# EAGLE design WeBee (EAGLE 7.1.0)

## Sheet 1 of 4
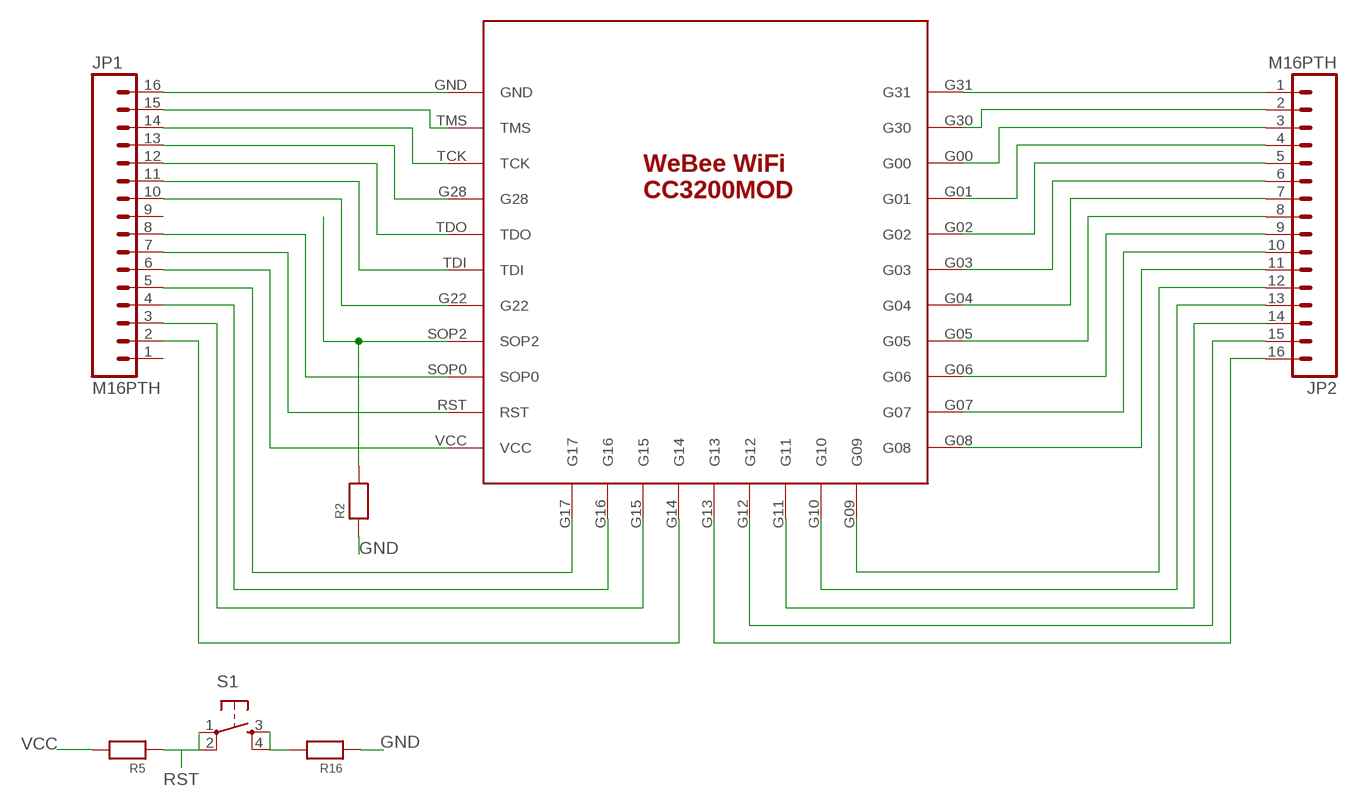
[diagram p0: schematic, sheet 1]

### Parts
JP1  M16PTH  [1X16]
JP2  M16PTH  [1X16]
R2  RESISTOR0402  [0402]
R5  RESISTOR0402  [0402]
R16  RESISTOR0402  [0402]
S1  TAC_SWITCHSMD  [TACTILE_SWITCH_SMD]
U$1  WEBEE_WIFI_CC3200  [CC3200]

### Nets
FTDI_RX: JP2.4 U$1.G01 ; also sheet 4
FTDI_TX: JP2.5 U$1.G02 ; also sheet 4
G00: JP2.3 U$1.G00
GND [vcc]: JP1.16 R2.1 R16.1 U$1.GND ; also sheet 2,3,4
N$1: R16.2 S1.3 S1.4
N$2: JP1.15 U$1.TMS
N$3: JP1.14 U$1.TCK
N$4: JP1.13 U$1.G28
N$5: JP1.12 U$1.TDO
N$6: JP1.11 U$1.TDI
N$7: JP1.10 U$1.G22
N$9: JP1.8 U$1.SOP0
N$12: JP2.1 U$1.G31
N$13: JP2.2 U$1.G30
N$17: JP2.6 U$1.G03
N$18: JP2.7 U$1.G04
N$19: JP2.8 U$1.G05
N$20: JP2.9 U$1.G06
N$21: JP2.10 U$1.G07
N$22: JP2.11 U$1.G08
N$23: JP2.12 U$1.G09
N$24: JP1.5 U$1.G17
N$25: JP2.13 U$1.G10
N$26: JP2.14 U$1.G11
N$27: JP2.15 U$1.G12
N$28: JP2.16 U$1.G13
N$29: JP1.4 U$1.G16
N$30: JP1.3 U$1.G15
N$31: JP1.2 U$1.G14
RST: JP1.7 R5.1 S1.2 U$1.RST ; also sheet 4
SOP2: R2.2 U$1.SOP2 ; also sheet 4
VCC: JP1.6 R5.2 U$1.VCC ; also sheet 3,4
Unconnected: JP1.1 JP1.9 S1.1

## Sheet 2 of 4
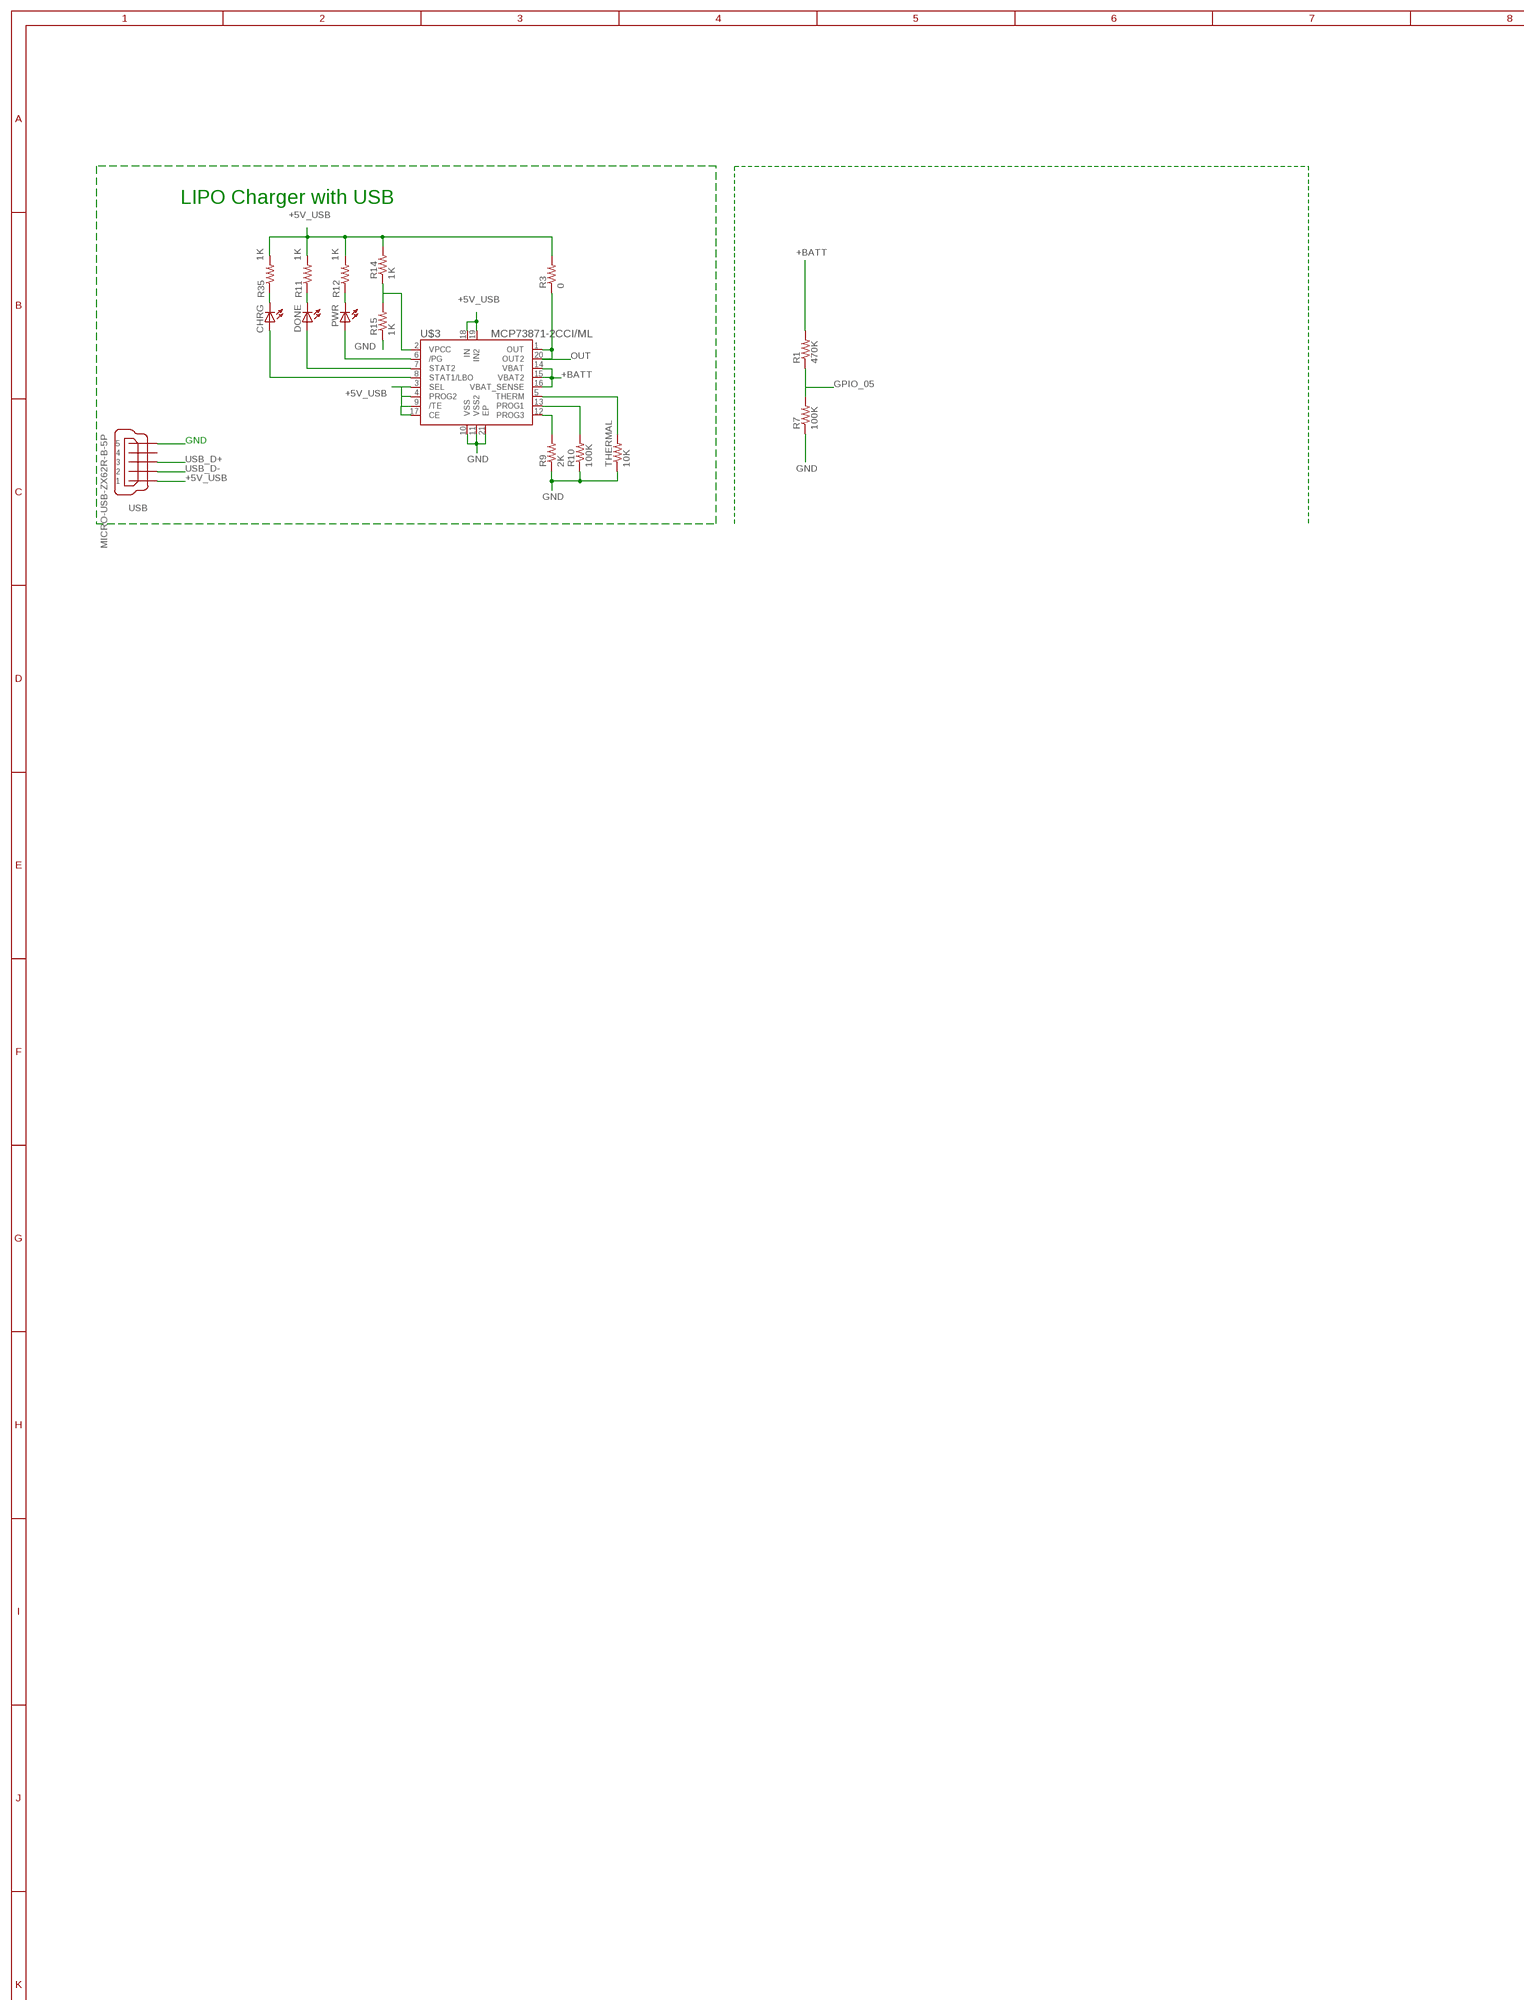
[diagram p1: schematic, sheet 2, part 1 of 3]
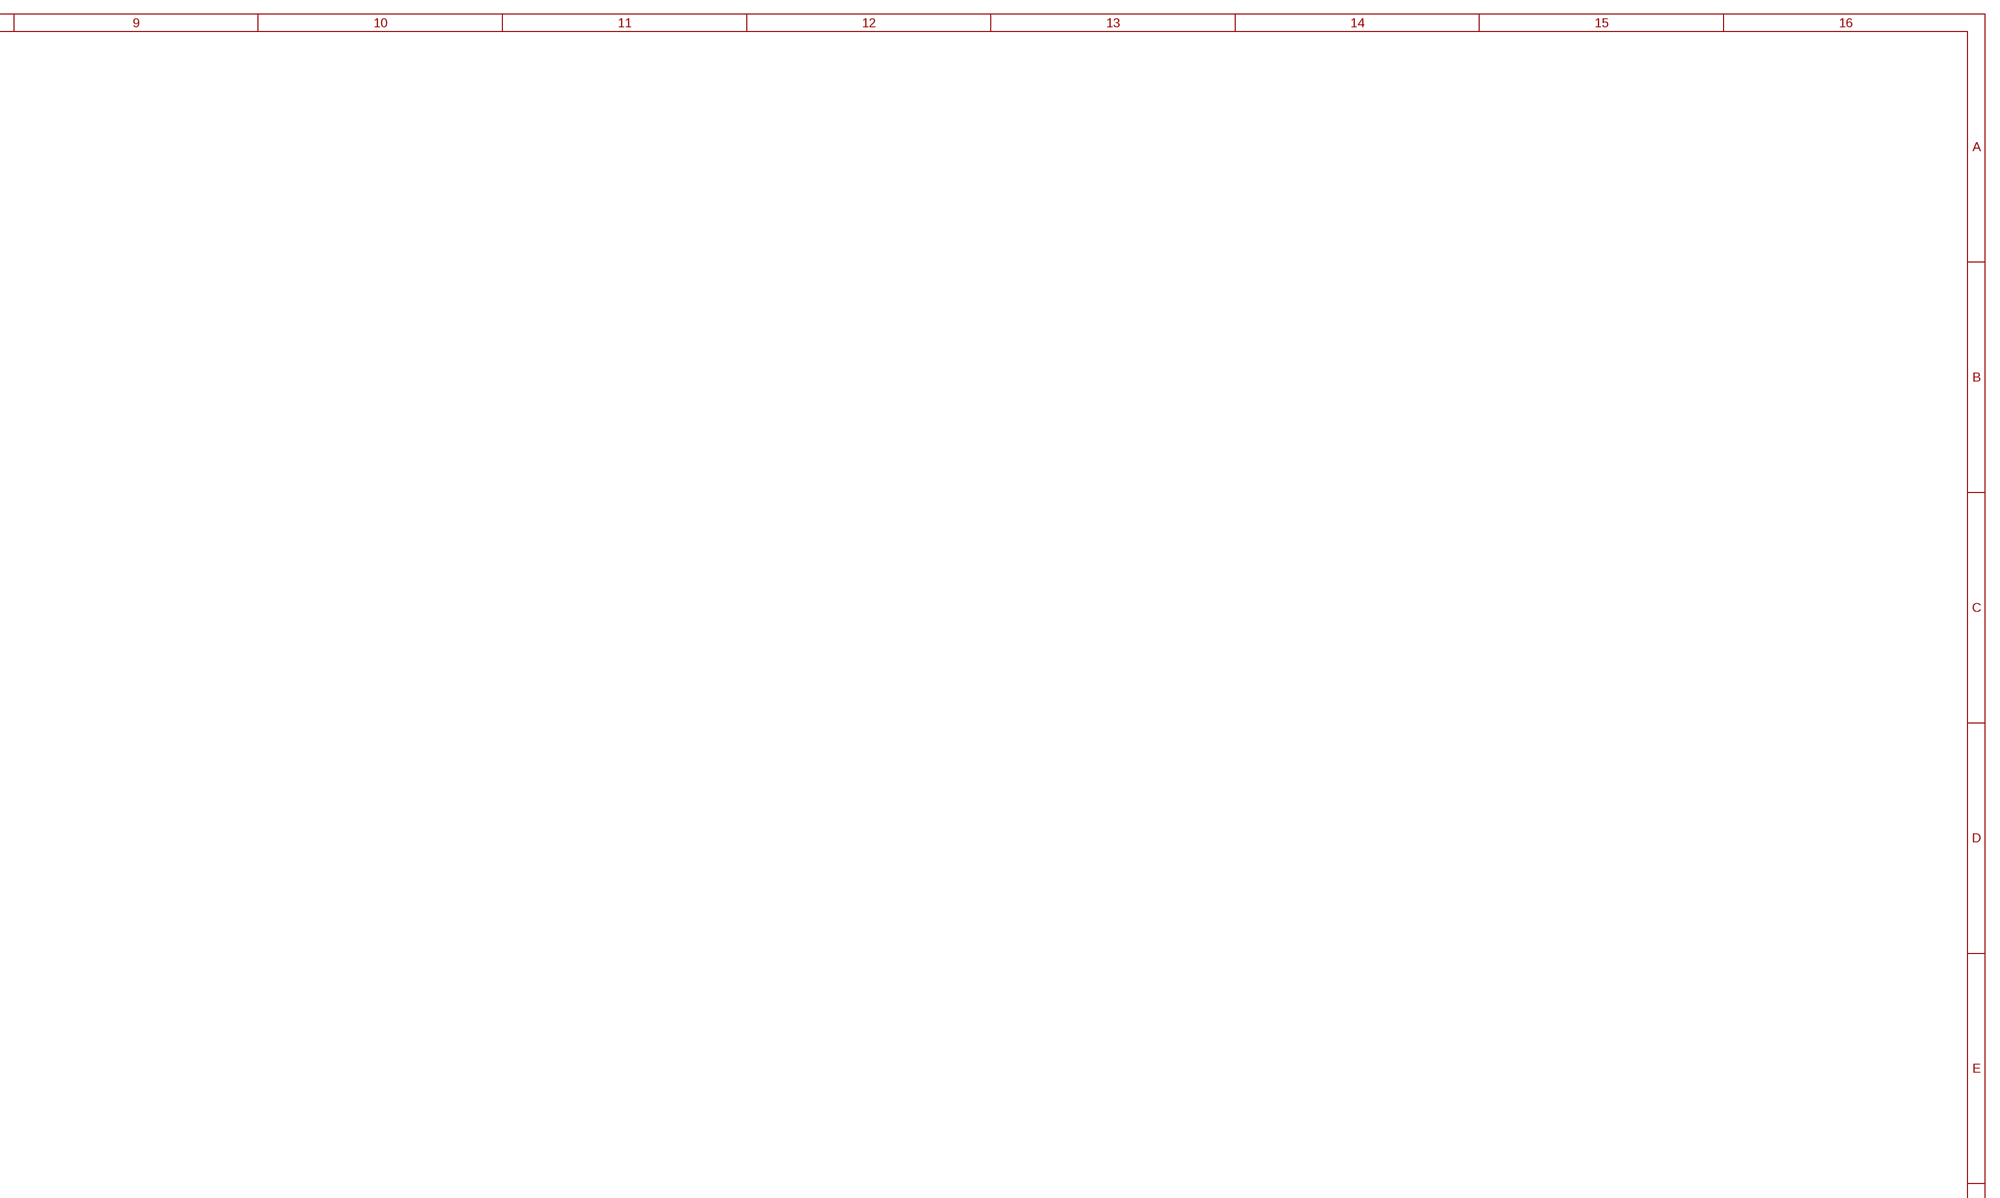
[diagram p2: schematic, sheet 2, part 2 of 3]
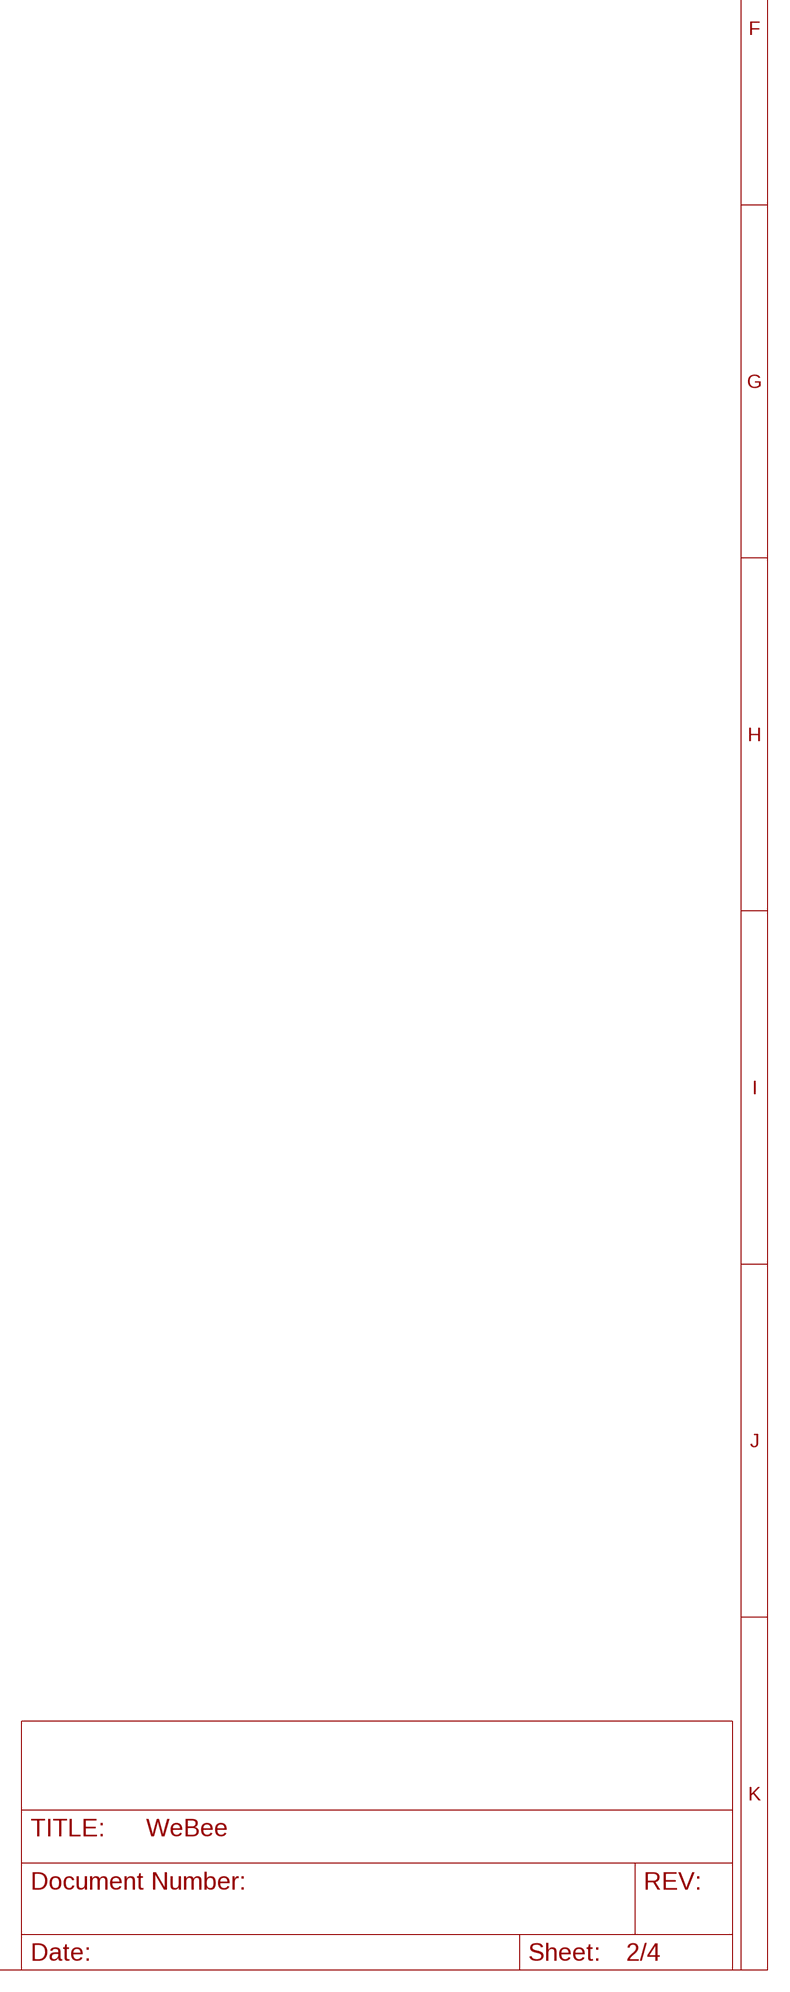
[diagram p3: schematic, sheet 2, part 3 of 3]

### Parts
CHRG  LEDSML0603  [SML0603]
DONE  LEDSML0603  [SML0603]
PWR  LEDSML0603  [SML0603]
R1  470K  RESISTOR0603  [0603-RES]
R3  0  RESISTOR0603-RES  [0603-RES]
R7  100K  RESISTOR0603  [0603-RES]
R9  2K  RESISTOR0603-RES  [0603-RES]
R10  100K  RESISTOR0603-RES  [0603-RES]
R11  1K  RESISTOR0402-RES  [0402-RES]
R12  1K  RESISTOR0402-RES  [0402-RES]
R14  1K  RESISTOR0603-RES  [0603-RES]
R15  1K  RESISTOR0603-RES  [0603-RES]
R35  1K  RESISTOR0402-RES  [0402-RES]
THERMAL  10K  RESISTOR0603-RES  [0603-RES]
U$3  MCP73871-2CCI/ML  [QFN20-4X4]
USB  MICRO-USB-ZX62R-B-5P  [ZX62R-B-5P]

### Nets
+5V_USB: R3.2 R11.2 R12.2 R14.2 R35.2 U$3.3(SEL) U$3.4(PROG2) U$3.9(/TE) U$3.17(CE) U$3.18(IN) U$3.19(IN2) USB.1 ; also sheet 4
+BATT: R1.2 U$3.14(VBAT) U$3.15(VBAT2) U$3.16(VBAT_SENSE) ; also sheet 3
GND [vcc]: R7.1 R9.1 R10.1 R15.1 THERMAL.1 U$3.10(VSS) U$3.11(VSS2) U$3.21(EP) USB.5 ; also sheet 1,3,4
GPIO_05: R1.1 R7.2
N$68: R9.2 U$3.12(PROG3)
N$69: R10.2 U$3.13(PROG1)
N$70: PWR.A U$3.6(/PG)
N$71: DONE.A U$3.7(STAT2)
N$72: CHRG.A U$3.8(STAT1/LBO)
N$73: CHRG.C R35.1
N$74: DONE.C R11.1
N$75: PWR.C R12.1
N$76: R14.1 R15.2 U$3.2(VPCC)
N$77: THERMAL.2 U$3.5(THERM)
OUT: R3.1 U$3.1(OUT) U$3.20(OUT2) ; also sheet 3
USB_D+: USB.3 ; also sheet 4
USB_D-: USB.2 ; also sheet 4
Unconnected: USB.4

### Notes on the sheet
- LIPO Charger with USB
- GND

## Sheet 3 of 4
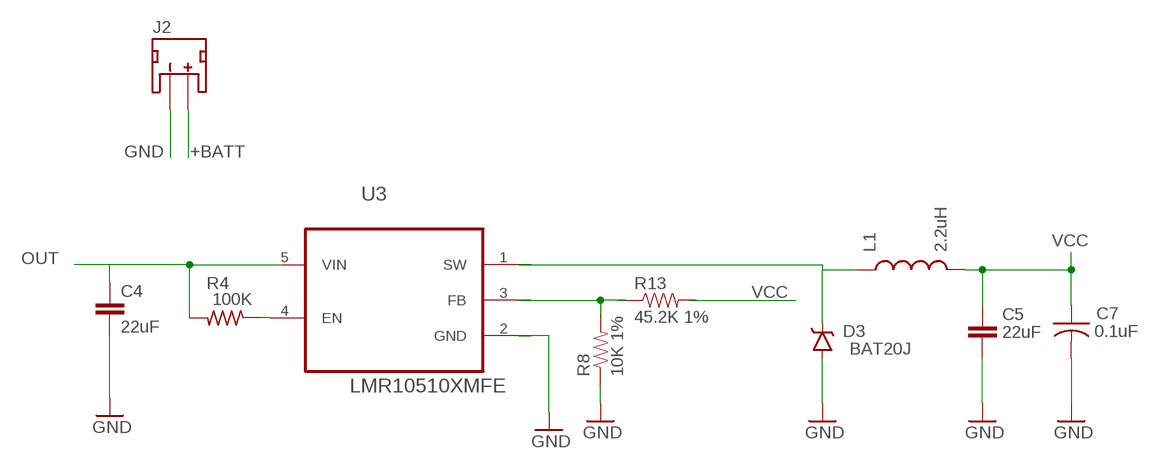
[diagram p4: schematic, sheet 3]

### Parts
C4  22uF  C-EUC0603  [C0603]
C5  22uF  C-EUC0603  [C0603]
C7  0.1uF  C-USC0402  [C0402]
D3  BAT20J  DIODE-SCHOTTKY-BAT20J  [SOD-323]
J2  JST_2MM_MALE  [JST-2-SMD]
L1  2.2uH  INDUCTOR-SPARKFUN0805  [0805]
R4  100K  R-US_R0402  [R0402]
R8  10K 1%  RESISTOR0402-RES  [0402-RES]
R13  45.2K 1%  RESISTOR0402-RES  [0402-RES]
U3  LMR10510XMFE  [SOT95P270X145-5N]

### Nets
+BATT: J2.2(+) ; also sheet 2
FB: R8.2 R13.1 U3.3(FB)
GND [vcc]: C4.2 C5.2 C7.2 D3.A J2.1(-) R8.1 U3.2(GND) ; also sheet 1,2,4
N$11: R4.1 U3.4(EN)
OUT: C4.1 R4.2 U3.5(VIN) ; also sheet 2
SW: D3.C L1.1 U3.1(SW)
VCC: C5.1 C7.1 L1.2 R13.2 ; also sheet 1,4
Unconnected: J2.NC1(PAD1) J2.NC2(PAD2)

## Sheet 4 of 4
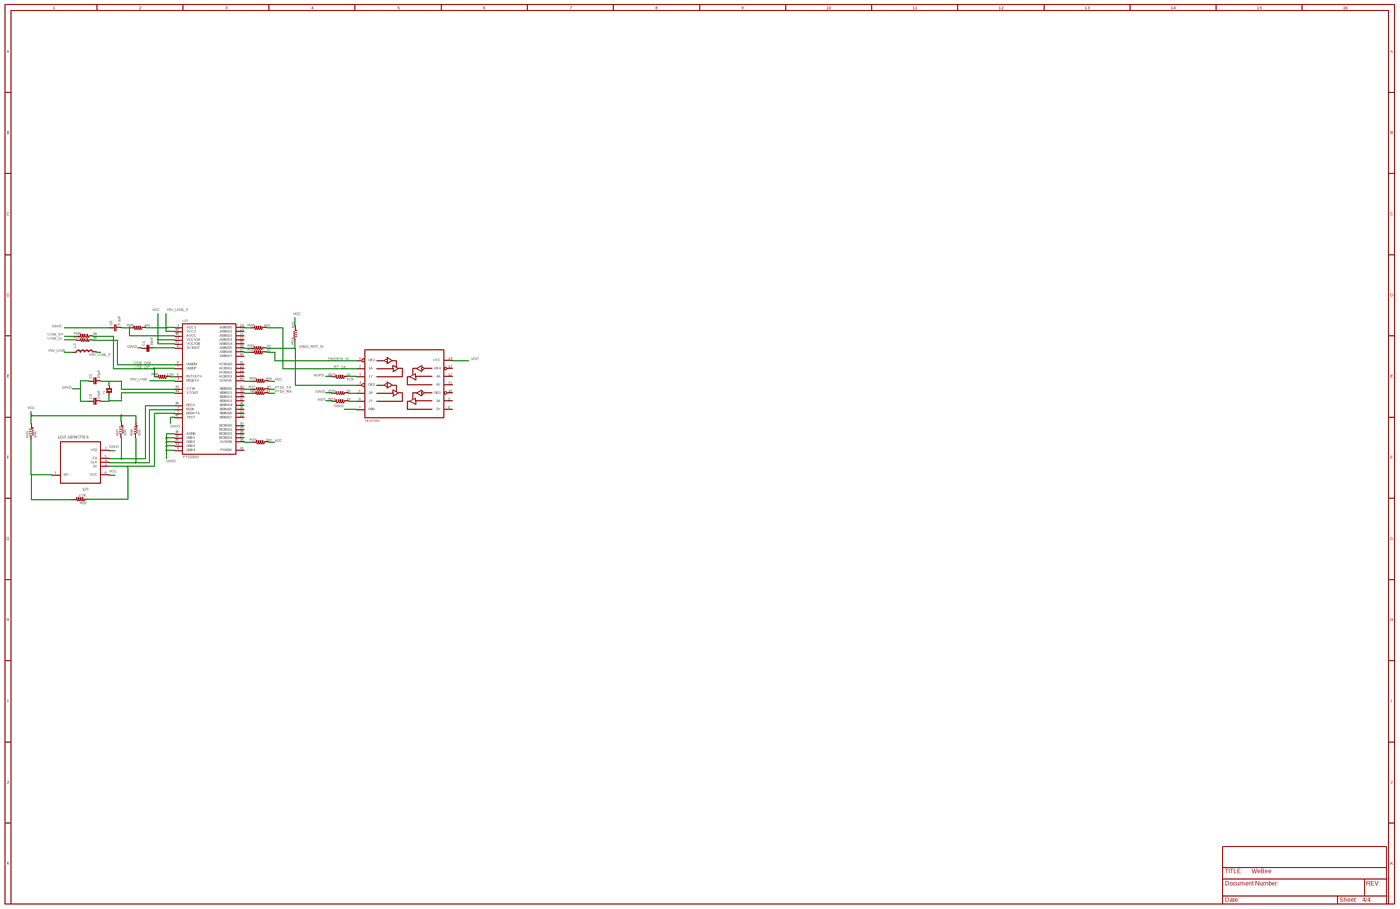
[diagram p5: schematic, sheet 4, overview]
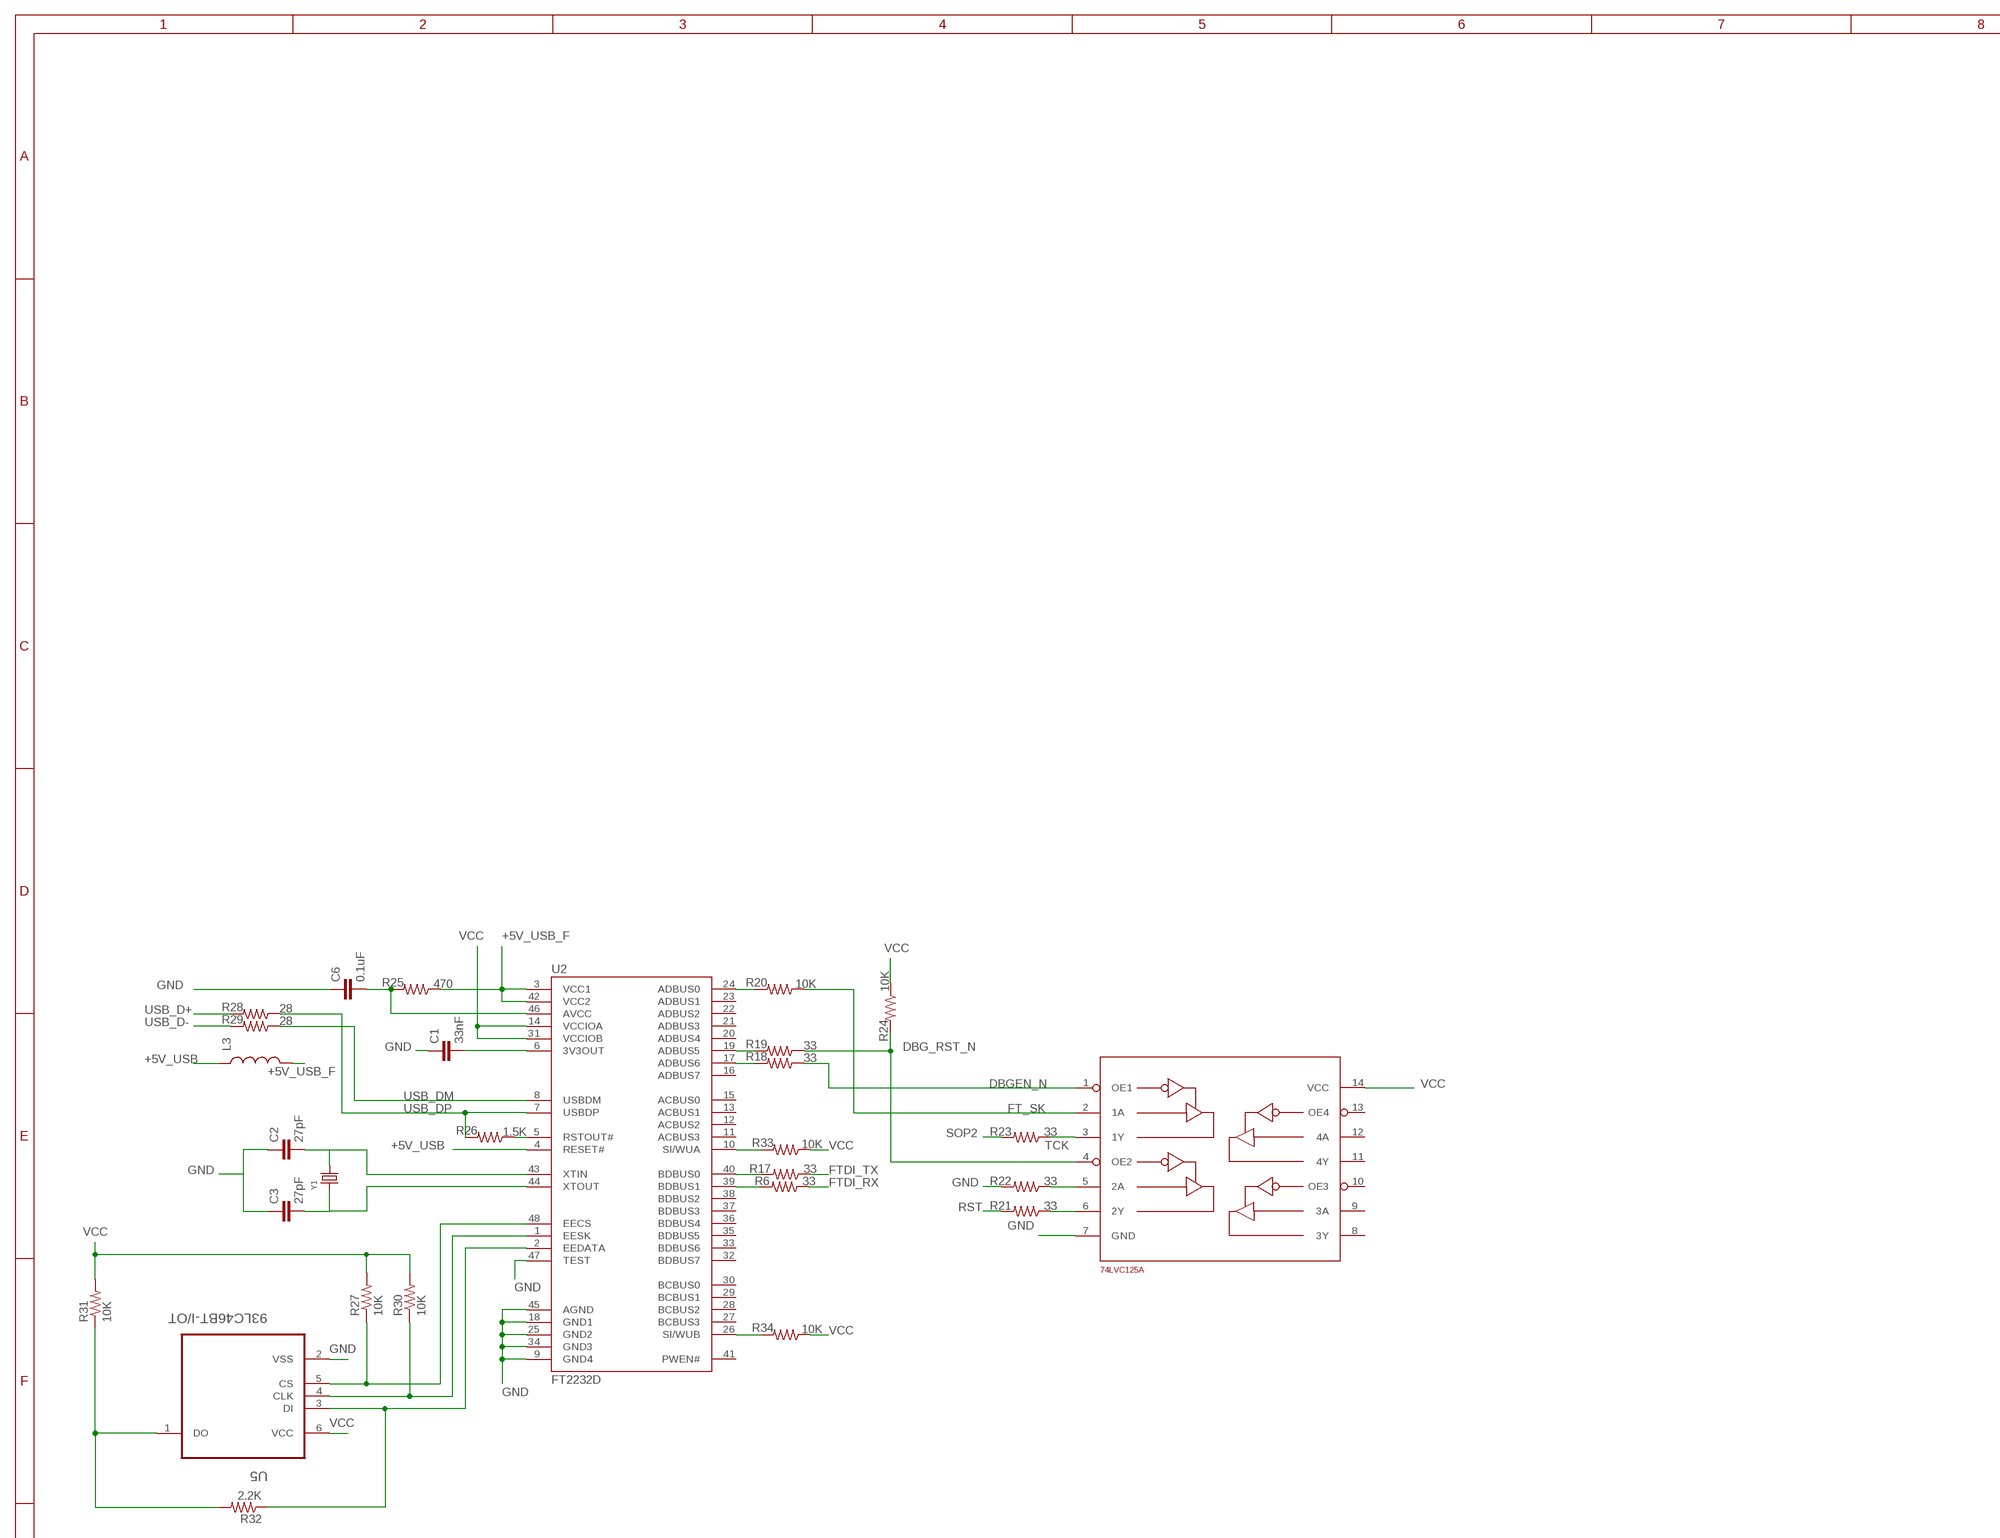
[diagram p6: schematic, sheet 4, part 1 of 4]
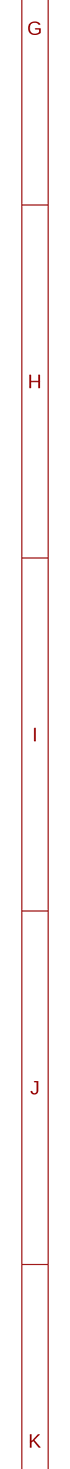
[diagram p7: schematic, sheet 4, part 2 of 4]
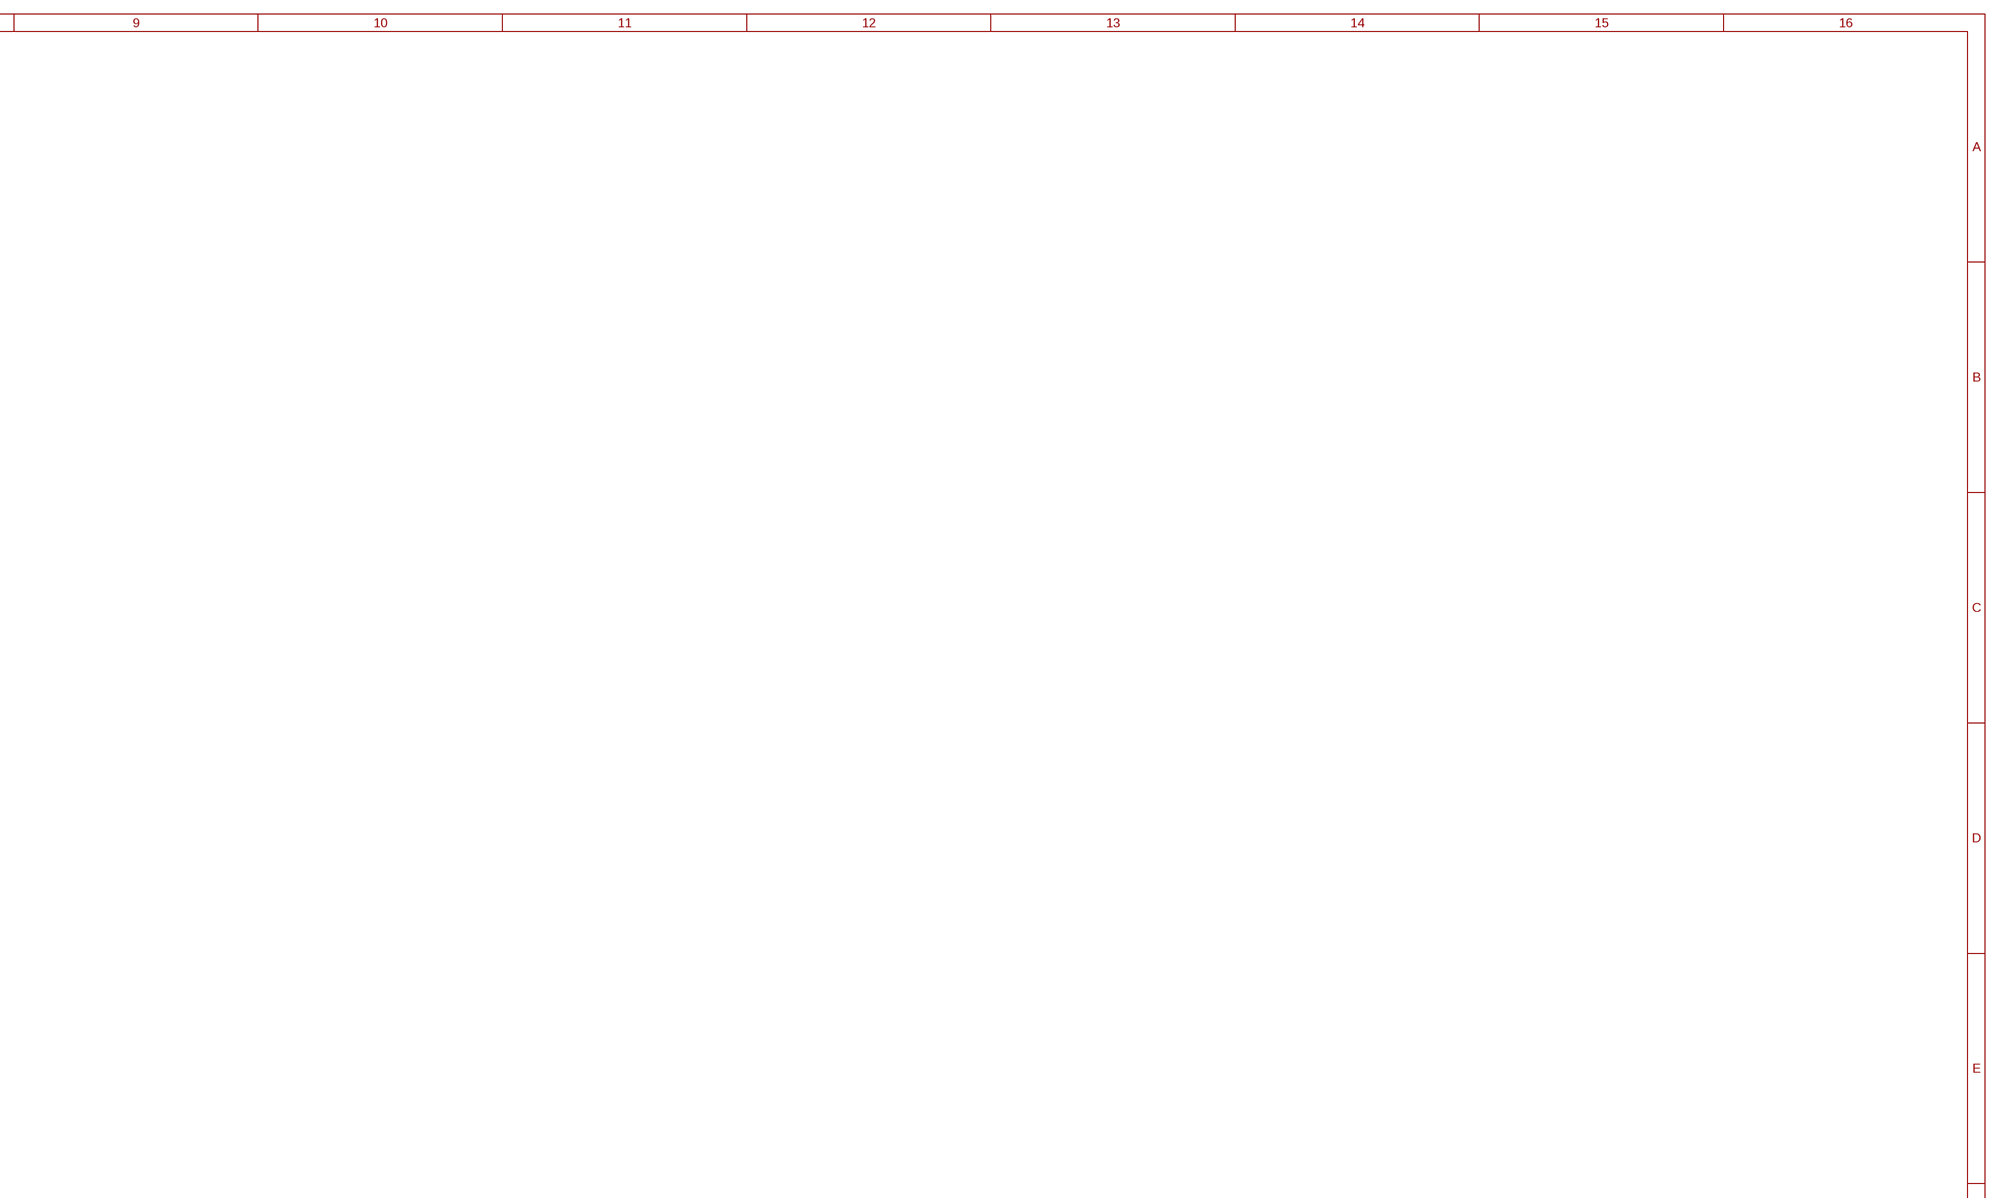
[diagram p8: schematic, sheet 4, part 3 of 4]
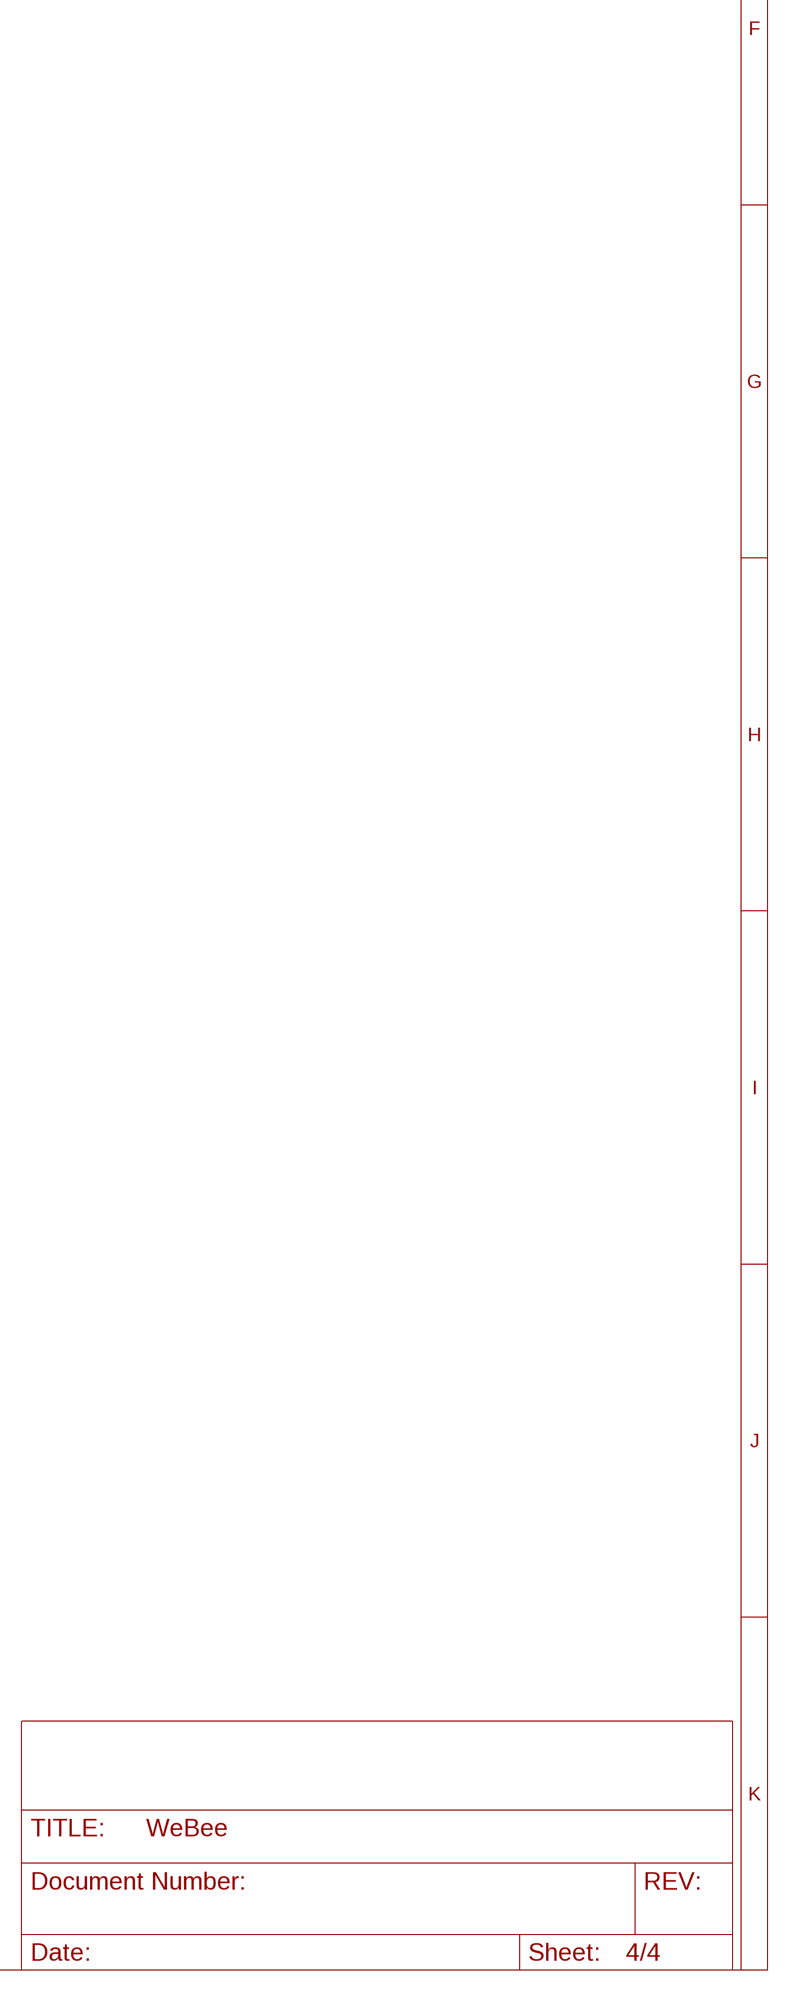
[diagram p9: schematic, sheet 4, part 4 of 4]

### Parts
C1  33nF  CAP0402-CAP  [0402-CAP]
C2  27pF  CAP0402-CAP  [0402-CAP]
C3  27pF  CAP0402-CAP  [0402-CAP]
C6  0.1uF  CAP0402-CAP  [0402-CAP]
L3  INDUCTOR-SPARKFUN0603  [0603]
R6  33  RESISTOR0402-RES  [0402-RES]
R17  33  RESISTOR0402-RES  [0402-RES]
R18  33  RESISTOR0402-RES  [0402-RES]
R19  33  RESISTOR0402-RES  [0402-RES]
R20  10K  RESISTOR0402-RES  [0402-RES]
R21  33  RESISTOR0402-RES  [0402-RES]
R22  33  RESISTOR0402-RES  [0402-RES]
R23  33  RESISTOR0402-RES  [0402-RES]
R24  10K  RESISTOR0402-RES  [0402-RES]
R25  470  RESISTOR0402-RES  [0402-RES]
R26  1.5K  RESISTOR0402-RES  [0402-RES]
R27  10K  RESISTOR0402-RES  [0402-RES]
R28  28  RESISTOR0402-RES  [0402-RES]
R29  28  RESISTOR0402-RES  [0402-RES]
R30  10K  RESISTOR0402-RES  [0402-RES]
R31  10K  RESISTOR0402-RES  [0402-RES]
R32  2.2K  RESISTOR0402-RES  [0402-RES]
R33  10K  RESISTOR0402-RES  [0402-RES]
R34  10K  RESISTOR0402-RES  [0402-RES]
U2  FT2232D  [LQFP-48]
U5  93LC46BT-I/OT  [SOT95P280X145-6N]
U$4  DECADE-74LVC125A  [DECADE-SO-14]
Y1  CRYSTAL2.5X2.0MM  [CRYSTAL_2.5X2]

### Nets
+5V_USB: L3.1 U2.4(RESET#) ; also sheet 2
+5V_USB_F: L3.2 R25.1 U2.3(VCC1) U2.42(VCC2)
DBG_RST_N: R19.1 R24.2 U$4.4(OE2)
DBGEN_N: R18.1 U$4.1(OE1)
FT_SK: R20.1 U$4.2(1A)
FTDI_RX: R6.1 ; also sheet 1
FTDI_TX: R17.1 ; also sheet 1
GND [vcc]: C1.1 C2.1 C3.1 C6.1 R22.2 U2.9(GND4) U2.18(GND1) U2.25(GND2) U2.34(GND3) U2.45(AGND) U2.47(TEST) U5.2(VSS) U$4.7(GND) ; also sheet 1,2,3
N$8: R26.1 U2.5(RSTOUT#)
N$38: C2.2 U2.43(XTIN) Y1.3
N$39: R27.1 U2.48(EECS) U5.5(CS)
N$40: C3.2 U2.44(XTOUT) Y1.1
N$41: R30.1 U2.1(EESK) U5.4(CLK)
N$42: R32.1 U2.2(EEDATA) U5.3(DI)
N$43: C1.2 U2.6(3V3OUT)
N$44: R17.2 U2.40(BDBUS0)
N$45: R6.2 U2.39(BDBUS1)
N$46: R20.2 U2.24(ADBUS0)
N$47: R19.2 U2.19(ADBUS5)
N$48: R18.2 U2.17(ADBUS6)
N$49: R22.1 U$4.5(2A)
N$50: R21.1 U$4.6(2Y)
N$51: C6.2 R25.2 U2.46(AVCC)
N$54: R31.1 R32.2 U5.1(DO)
N$55: R33.2 U2.10(SI/WUA)
N$56: R34.2 U2.26(SI/WUB)
RST: R21.2 ; also sheet 1
SOP2: R23.2 ; also sheet 1
TCK: R23.1 U$4.3(1Y)
USB_D+: R28.2 ; also sheet 2
USB_D-: R29.2 ; also sheet 2
USB_DM: R29.1 U2.8(USBDM)
USB_DP: R26.2 R28.1 U2.7(USBDP)
VCC: R24.1 R27.2 R30.2 R31.2 R33.1 U2.14(VCCIOA) U2.31(VCCIOB) U5.6(VCC) U$4.14(VCC) ; also sheet 1,3
Unconnected: R34.1 U2.11(ACBUS3) U2.12(ACBUS2) U2.13(ACBUS1) U2.15(ACBUS0) U2.16(ADBUS7) U2.20(ADBUS4) U2.21(ADBUS3) U2.22(ADBUS2) U2.23(ADBUS1) U2.27(BCBUS3) U2.28(BCBUS2) U2.29(BCBUS1) U2.30(BCBUS0) U2.32(BDBUS7) U2.33(BDBUS6) U2.35(BDBUS5) U2.36(BDBUS4) U2.37(BDBUS3) U2.38(BDBUS2) U2.41(PWEN#) U$4.8(3Y) U$4.9(3A) U$4.10(OE3) U$4.11(4Y) U$4.12(4A) U$4.13(OE4)

## Library data of the parts
C1-C3 C6 = SparkFun-Passives:CAP: Capacitor Standard 0603 ceramic capacitor, and 0.1" leaded capacitor.
C4 C5 = rcl:C-EU: CAPACITOR, European symbol
C7 = adafruit:C-US: CAPACITOR, American symbol
CHRG DONE PWR = led:LED: LED OSRAM: - CHIPLED LG R971, LG N971, LY N971, LG Q971, LY Q971, LO R971, LY R971 LH N974, LH R974 LS Q976, LO Q976, LY Q976 LO Q996 - Hyper CHIPLED LW Q18S LB Q993, LB Q99A, LB R99A - SideLED LS A670, LO A670, LY A670, LG A670, LP A670 LB A673, LV A673, LT A673, LW A673 LH A674 LY A675 LS A676, LA A676, LO A676, LY A676, LW A676 LS A679, LY A679, LG A679 - Hyper Micro SIDELED® LS Y876, LA Y876, LO Y876, LY Y876 LT Y87S - SmartLED LW L88C, LW L88S LB L89C, LB L89S, LG L890 LS L89K, LO L89K, LY L89K LS L896, LA L896, LO L896, LY L896 - TOPLED LS T670, LO T670, LY T670, LG T670, LP T670 LSG T670, LSP T670, LSY T670, LOP T670, LYG T670 LG T671, LOG T671, LSG T671 LB T673, LV T673, LT T673, LW T673 LH T674 LS T676, LA T676, LO T676, LY T676, LB T676, LH T676, LSB T676, LW T676 LB T67C, LV T67C, LT T67C, LS T67K, LO T67K, LY T67K, LW E67C LS E67B, LA E67B, LO E67B, LY E67B, LB E67C, LV E67C, LT E67C LW T67C LS T679, LY T679, LG T679 LS T770, LO T770, LY T770, LG T770, LP T770 LB T773, LV T773, LT T773, LW T773 LH T774 LS E675, LA E675, LY E675, LS T675 LS T776, LA T776, LO T776, LY T776, LB T776 LHGB T686 LT T68C, LB T68C - Hyper Mini TOPLED® LB M676 - Mini TOPLED Santana® LG M470 LS M47K, LO M47K, LY M47K Source: http://www.osram.convergy.de LUXEON: - LUMILED® LXK2-PW12-R00, LXK2-PW12-S00, LXK2-PW14-U00, LXK2-PW14-V00 LXK2-PM12-R00, LXK2-PM12-S00, LXK2-PM14-U00 LXK2-PE12-Q00, LXK2-PE12-R00, LXK2-PE12-S00, LXK2-PE14-T00, LXK2-PE14-U00 LXK2-PB12-K00, LXK2-PB12-L00, LXK2-PB12-M00, LXK2-PB14-N00, LXK2-PB14-P00, LXK2-PB14-Q00 LXK2-PR12-L00, LXK2-PR12-M00, LXK2-PR14-Q00, LXK2-PR14-R00 LXK2-PD12-Q00, LXK2-PD12-R00, LXK2-PD12-S00 LXK2-PH12-R00, LXK2-PH12-S00 LXK2-PL12-P00, LXK2-PL12-Q00, LXK2-PL12-R00 Source: www.luxeon.com KINGBRIGHT: KA-3528ASYC Source: www.kingbright.com
D3 = SparkFun-DiscreteSemi:DIODE-SCHOTTKY: Schottky diodes in SFE's production catalog BAT20J 1A 23V 0.62Vf RB751 120mA 40V 0.37Vf PMEG4005EJ 0.5A 40V 0.42Vf MBRA140 1A 40V 0.5Vf B340A 3A 40V SMA; PROD_ID: DIO-11623
J2 = SparkFun-Connectors:JST_2MM_MALE: Mates to single-cell LiPo batteries. CONN-08352; PROD_ID: CONN-08352
JP1 JP2 = DECADE-libraries:M16: 1x16 .1" header
L1 L3 = Spark:INDUCTOR-SPARKFUN: Inductors Basic Inductor/Choke - 0603 and 1206. Footprints are not proven and vary greatly between part numbers. SRN6045- 33uH, 20% 1.4A
R1 R7 = SparkFun-Resistors:RESISTOR: Resistor Basic schematic elements and footprints for 0603, 1206, and PTH resistors.
R2 R5 R16 = microbuilder:RESISTOR: Resistors 0402 - 0402 Surface Mount Package 22 Ohm 1% 1/16W [Digikey: 311-22.0LRTR-ND] 33 Ohm 5% 1/16W 1.0K 5% 1/16W 1.5K 5% 1/16W 2.0K 1% 1/16W 10.0K 1% 1/16W [Digikey: 311-10.0KLRTR-ND] 10.0K 5% 1/16W [Digikey: RMCF0402JT10K0TR-ND] 12.1K 1% 1/16W [Digikey: 311-22.0LRTR-ND] 100.0K 5% 1/16W 0603 - 0603 Surface Mount Package 0 Ohm 1/10 Watt 1% Resistor 15 Ohm 1/10 Watt 1% Resistor 33 Ohm 1/10 Watt 1% Resistor 49.9 Ohm 1/10 Watt 1% Resistor 100 Ohm 1/10 Watt 1% Resistor 150 Ohm 1/10 Watt 1% Resistor 240 Ohm 1/10 Watt 1% Resistor 390 Ohm 1/10 Watt 1% Resistor 560 Ohm 1/10 Watt 1% Resistor 680 Ohm 1/10 Watt 1% Resistor 750 Ohm 1/10 Watt 1% Resistor 1.0K Ohm 1/10 Watt 1% Resistor 1.5K Ohm 1/10 Watt 1% Resistor 2.0K Ohm 1/10 Watt 1% Resistor 2.2K Ohm 1/10 Watt 1% Resistor 3.3K Ohm 1/10 Watt 1% Resistor 4.7K Ohm 1/10 Watt 1% Resistor 10.0K Ohm 1/10 Watt 1% Resistor 12.0K Ohm 1/10 Watt 1% Resistor 12.1K Ohm 1/10 Watt 1% Resistor 20.0K Ohm 1/10 Watt 1% Resistor 33.0K Ohm 1/10 Watt 1% Resistor 100.0K Ohm 1/10 Watt 1% Resistor 0805 - 0805 Surface Mount Package 0 Ohm 1/8 Watt 1% Resistor 33 Ohm 1/8 Watt 1% Resistor 100 Ohm 1/8 Watt 1% Resistor 150 Ohm 1/8 Watt 1% Resistor 200 Ohm 1/8 Watt 1% Resistor 240 Ohm 1/8 Watt 1% Resistor 330 Ohm 1/8 Watt 1% Resistor 390 Ohm 1/8 Watt 1% Resistor 470 Ohm 1/8 Watt 1% Resistor 1.0K Ohm 1/8 Watt 1% Resistor 1.5K Ohm 1/8 Watt 1% Resistor 2.0K Ohm 1/8 Watt 1% Resistor 4.7K Ohm 1/8 Watt 1% Resistor 5.1K Ohm 1/8 Watt 1% Resistor 5.6K Ohm 1/8 Watt 1% Resistor 10.0K Ohm 1/8 Watt 1% Resistor 22.0K Ohm 1/8 Watt 1% Resistor 33.0K Ohm 1/8 Watt 1% Resistor 100K Ohm 1/8 Watt 1% Resistor 1206 - 1206 Surface Mount Package 2012 - 2010 Surface Mount Package 0.11 Ohm 1/2 Watt 1% Resistor - Digikey: RHM.11UCT-ND
R3 R6 R8-R15 R17-R35 THERMAL = SparkFun-Passives:RESISTOR: Resistor Basic schematic elements and footprints for 0603, 1206, and PTH resistors.
R4 = adafruit:R-US_: RESISTOR, American symbol
S1 = Spark:TAC_SWITCH: SMD Tactiile Switch
U2 = SparkFun-DigitalIC:FT2232D: USB to USART/FIFO/JTAG/SPI/I2C
U3 = Microchip_By_element14_Batch_1:LMR10510XMFE
U5 = Microchip_By_element14_Batch_1:93LC46BT-I/OT: 1K Microwire Compatible Serial EEPROM; MPN: 93LC46BT-I/OT; OC_FARNELL: 1556164; OC_NEWARK: 75M3689; PACKAGE: SOT-6; SUPPLIER: Microchip
U$1 = WeeBee:WEBEE_WIFI_CC3200
U$3 = microchip-battery:MCP73871: Stand-Alone System Load Sharing and Li-Ion / Li-Polymer Battery Charge Managemen The MCP73871 device is a 1A fully integrated linear solution for system load sharing and Li-Ion / Li-Polymer battery charge management with AC-DC wall adapter and USB port power sources selection. It?s also capable of autonomous power source selection between input or battery. The MCP73871 device employs a constant current/constant voltage (CC/CV) charge algorithm with selectable charge termination point. The constant voltage regulation is fixed with four available options: 4.10V, 4.20V, 4.35V, or 4.40V.; LBO: 3.1 V; SAFETYTIMER: 6 Hours; VREG: 4.20V
U$4 = DECADE-libraries:DECADE-74LVC125A
USB = con-hirose:MICRO-USB-: Hirose Micro USB Connector ZX62R-B-5P: Micro B, reverse (top mount) shell SMT Supplier: DigiKey H11574CT-ND Source: http://www.hirose.co.jp/cataloge_hp/e24200011.pdf
Y1 = microbuilder:CRYSTAL: Crystals HC49UP - Surface Mount Crystal 4.0MHz 18pF +/-30ppm Surface Mount Crystal [Digikey: 535-9857-1-ND] 12.0 MHz Surface Mount Crystal [Digikey: 535-9869-6-ND] 25.0 MHz Surface Mount Crystal [Digikey: 535-9078-1-ND] 2.5 x 2.0mm - MEMs SMT Crystal 16.0 MHz 10pF 20ppm 2.5 x 2.0mm Crystal [Digikey -40-85°C: 535-10923-1-ND] 3.2 x 2.5mm - MEMs SMT Crystal 12.0 MHz 8pF 15ppm 3.2 x 2.5mm Crystal [Digikey: -10-70°C: 644-1047-1-ND -40-125°C: 644-1128-1-ND] 16.0 MHz 8pF 15ppm 3.2 x 2.5mm Crystal [Digikey: -10-70°C: 644-1049-1-ND -40-125°C: 644-1129-2-ND] 16.0 MHz 10pF 10ppm 3.2 x 2.5mm Crystal [Digikey: 644-1100-1-ND] 27.12 MHz 18pF 30ppm 3.2 x 2.5mm Crystal [Digikey: 887-1424-1-ND] 27.12MHz 10pF 10ppm 3.2 x 2.5mm Crystal [Digikey: 887-1329-1-ND] 4.9 x 1.8mm - MEMs SMT Crystal 32.768 KHz 12.5pF 20ppm 4.9 x 1.8mm Crystal [Digikey: SE2415CT-ND] 8.0 x 3.8mm - Surface Mount Crystal 32.768kHz 12.5pF 20ppm -40°C-85°C [Digikey: 535-9166-2-ND] Cylinder 32.768KHz Cylinder Crystal (2x6mm body) [Ex. Digikey: 300-8341-2-ND]

## Board
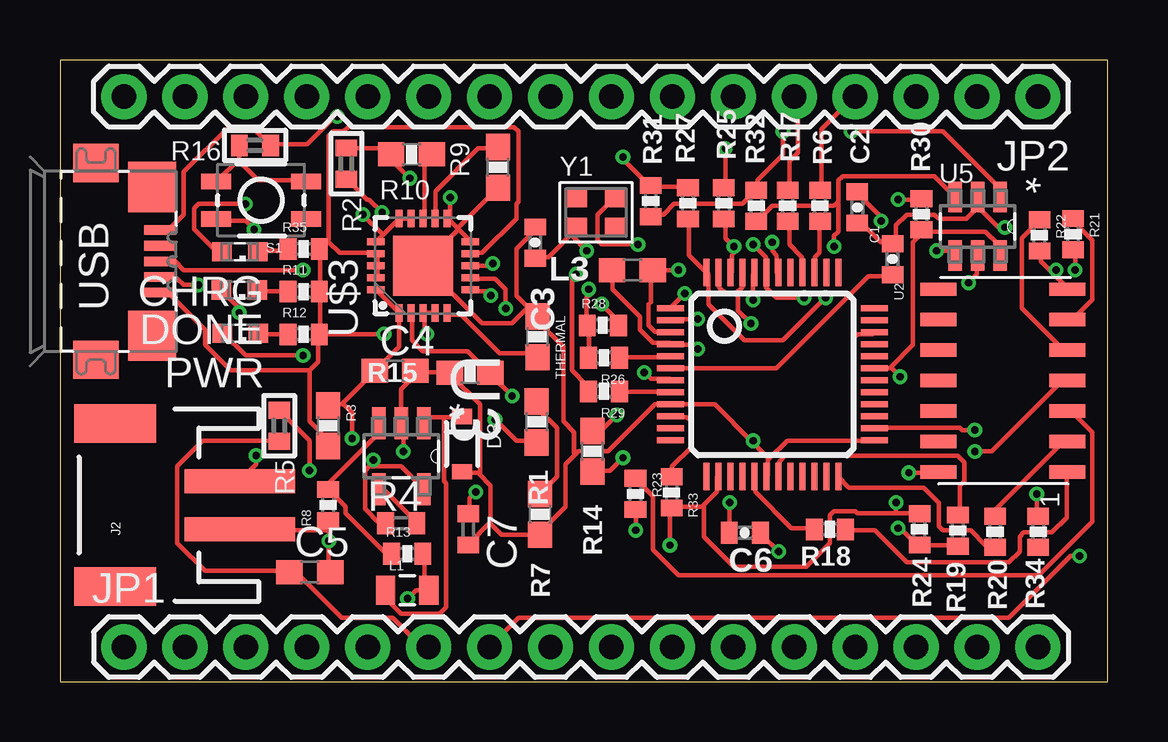
[diagram p10: board, top side]
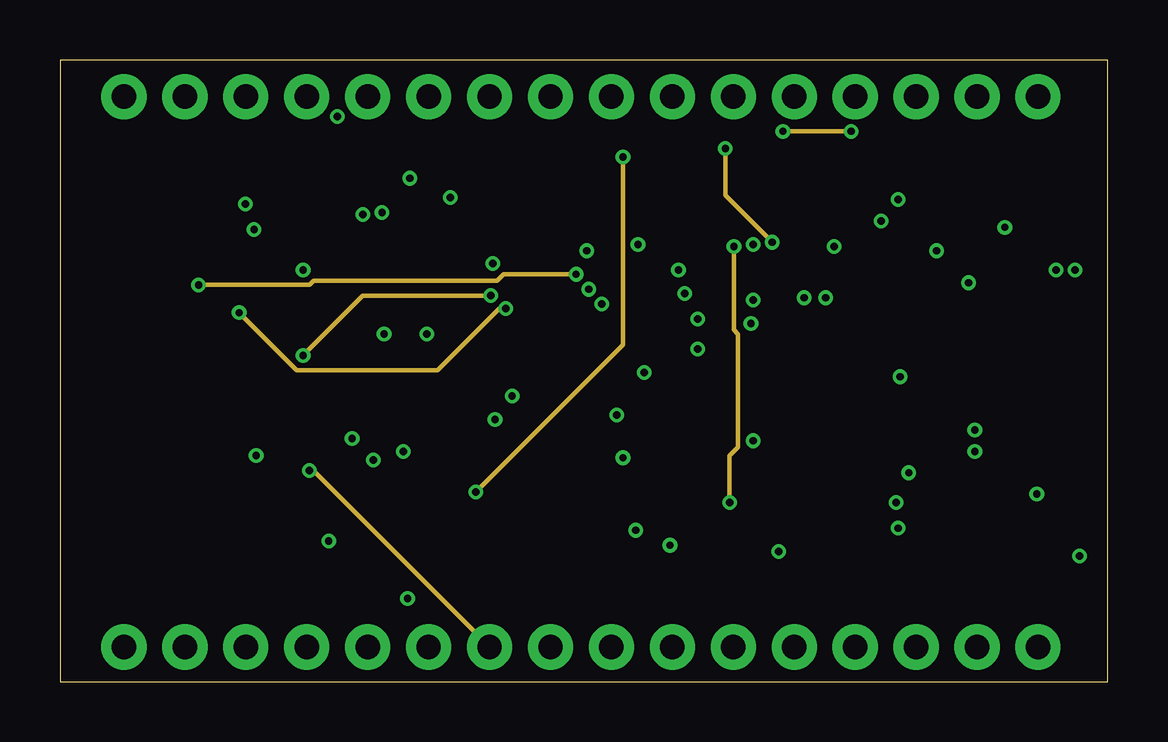
[diagram p11: board, inner layer Route2]
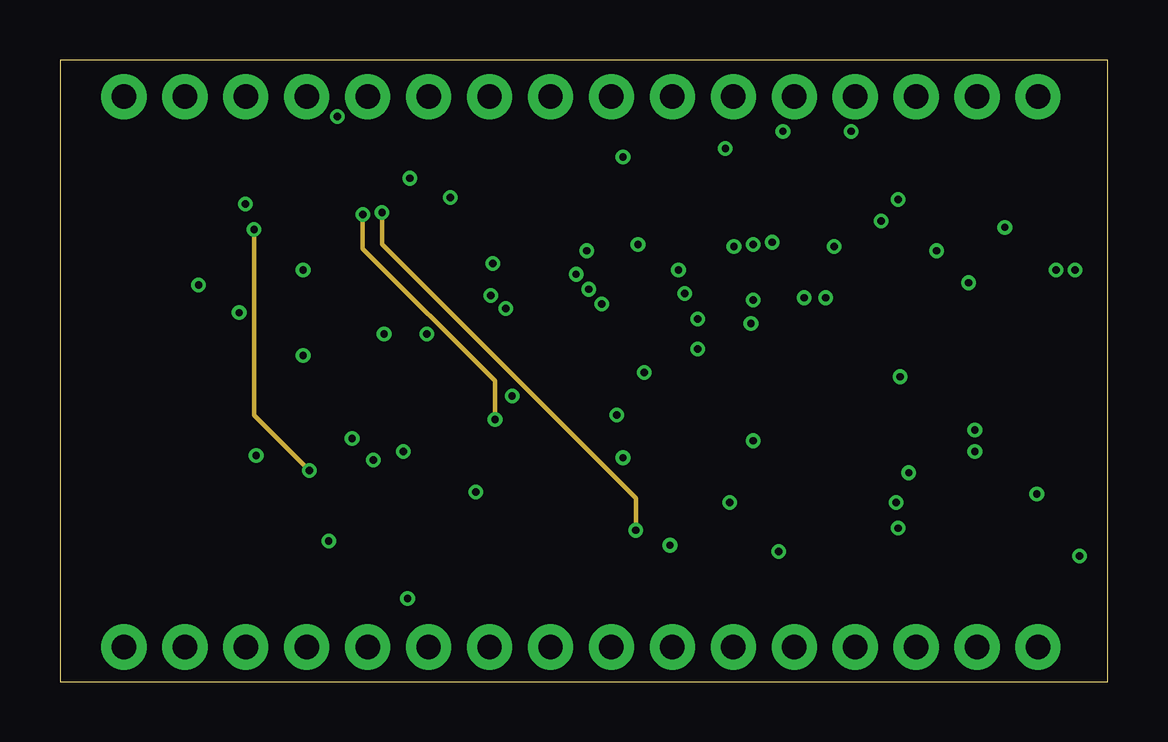
[diagram p12: board, inner layer Route15]
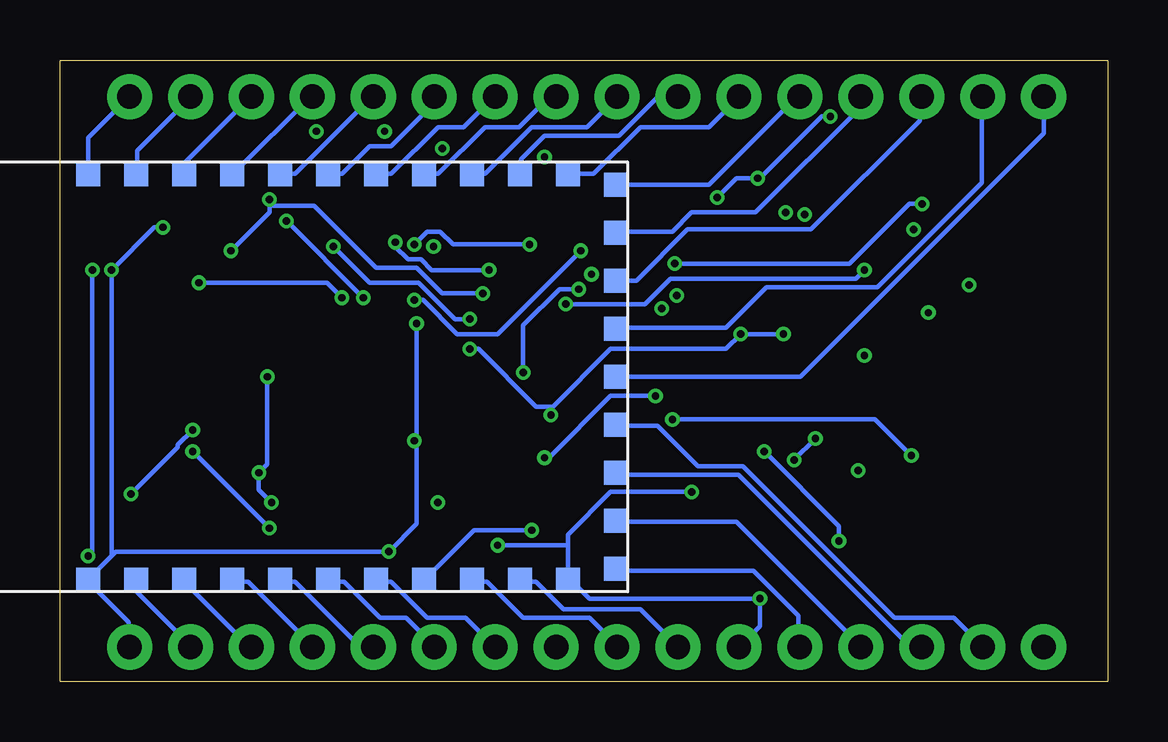
[diagram p13: board, bottom side, seen from below]

Size 43.67 x 25.91 mm. Coordinates in mm from the lower left corner, seen from the top.
Outline: 0,0 43.67,0 43.67,25.91 0,25.91 0,0
Copper layers (1*2*15*16): Top 0.035mm / dielectric 1.5mm / Route2 0.035mm / dielectric 0.15mm / Route15 0.035mm / dielectric 0.2mm / Bottom 0.035mm
Design rules "SmartEagleRules *": minimum track width 7mil, minimum drill 12mil, track to track 7mil, track to pad 7mil, pad to pad 7mil, via to via 7mil, smd to smd 0mil, copper to edge 20mil, drill to drill 10mil, minimum pad ring 10mil, minimum via ring 6mil, stop-mask expansion 2mil, vias tented up to drill 25mil, thermal gap 10mil

### Footprints (pad centres in the part's own frame; a part is rotated, then mirrored left to right if it is on the bottom)
0402-CAP = smd 0.7 x 0.9: 1 -0.65,0; 2 0.65,0
C0603 = smd 1.1 x 1: 1 -0.85,0; 2 0.85,0
C0402 = smd 0.7 x 0.9: 1 -0.65,0; 2 0.65,0
SML0603 = smd 0.8 x 0.8: A 0.75,0; C -0.75,0
SOD-323 = smd 0.63 x 0.83: A 1.15,0; C -1.15,0
JST-2-SMD = smd 1 x 4.6: 1 -1,-3.7; 2 1,-3.7 | smd 1.6 x 3.4: NC1 -3.4,1.5; NC2 3.4,1.5
1X16 = drill 1.016 pad 1.88: 1 0,0; 2 2.54,0; 3 5.08,0; 4 7.62,0; 5 10.16,0; 6 12.7,0; 7 15.24,0; 8 17.78,0; 9 20.32,0; 10 22.86,0; 11 25.4,0; 12 27.94,0; 13 30.48,0; 14 33.02,0; 15 35.56,0; 16 38.1,0
0805 = smd 0.8 x 1.2: 1 -0.9,0; 2 0.9,0
0603 = smd 1.1 x 1: 1 -0.85,0; 2 0.85,0
0603-RES = smd 1.1 x 1: 1 -0.85,0; 2 0.85,0
0402 = smd 0.7 x 0.9: 1 -0.65,0; 2 0.65,0
R0402 = smd 0.7 x 0.9: 1 -0.65,0; 2 0.65,0
0402-RES = smd 0.7 x 0.9: 1 -0.65,0; 2 0.65,0
TACTILE_SWITCH_SMD = smd 1.25 x 0.65: 1 -1.875,0.775; 2 1.875,0.775; 3 -1.875,-0.775; 4 1.875,-0.775
LQFP-48 = smd 0.254 x 1.143: 1 -2.75,-4.25; 2 -2.25,-4.25; 3 -1.75,-4.25; 4 -1.25,-4.25; 5 -0.75,-4.25; 6 -0.25,-4.25; 7 0.25,-4.25; 8 0.75,-4.25; 9 1.25,-4.25; 10 1.75,-4.25; 11 2.25,-4.25; 12 2.75,-4.25; 25 2.75,4.25; 26 2.25,4.25; 27 1.75,4.25; 28 1.25,4.25; 29 0.75,4.25; 30 0.25,4.25; 31 -0.25,4.25; 32 -0.75,4.25; 33 -1.25,4.25; 34 -1.75,4.25; 35 -2.25,4.25; 36 -2.75,4.25 | smd 1.143 x 0.254: 13 4.25,-2.75; 14 4.25,-2.25; 15 4.25,-1.75; 16 4.25,-1.25; 17 4.25,-0.75; 18 4.25,-0.25; 19 4.25,0.25; 20 4.25,0.75; 21 4.25,1.25; 22 4.25,1.75; 23 4.25,2.25; 24 4.25,2.75; 37 -4.25,2.75; 38 -4.25,2.25; 39 -4.25,1.75; 40 -4.25,1.25; 41 -4.25,0.75; 42 -4.25,0.25; 43 -4.25,-0.25; 44 -4.25,-0.75; 45 -4.25,-1.25; 46 -4.25,-1.75; 47 -4.25,-2.25; 48 -4.25,-2.75
SOT95P270X145-5N = smd 1.321 x 0.559: 1 -1.372,0.94; 2 -1.372,0; 3 -1.372,-0.94; 4 1.372,-0.94; 5 1.372,0.94
SOT95P280X145-6N = smd 1.27 x 0.559: 1 -1.219,0.94; 2 -1.219,0; 3 -1.219,-0.94; 4 1.219,-0.94; 5 1.219,0; 6 1.219,0.94
CC3200 = smd 1 x 1: G00 8.455,7; G01 8.455,5; G02 8.455,3; G03 8.455,1; G04 8.455,-1; G05 8.455,-3; G06 8.455,-5; G07 8.455,-7; G08 8.455,-9; G09 8,-11; G10 6,-11; G11 4,-11; G12 2,-11; G13 0,-11; G14 -2,-11; G15 -4,-11; G16 -6,-11; G17 -8,-11; G22 -8.455,-1; G28 -8.455,5; G30 8.455,9; G31 8.455,11; GND -8.455,11; RST -8.455,-7; SOP0 -8.455,-5; SOP2 -8.455,-3; TCK -8.455,7; TDI -8.455,1; TDO -8.455,3; TMS -8.455,9; VCC -8.455,-9
QFN20-4X4 = smd 0.73 x 0.3: 1 -1.965,1; 2 -1.965,0.5; 3 -1.965,0; 4 -1.965,-0.5; 5 -1.965,-1; 11 1.965,-1; 12 1.965,-0.5; 13 1.965,0; 14 1.965,0.5; 15 1.965,1 | smd 0.3 x 0.73: 6 -1,-1.965; 7 -0.5,-1.965; 8 0,-1.965; 9 0.5,-1.965; 10 1,-1.965; 16 1,1.965; 17 0.5,1.965; 18 0,1.965; 19 -0.5,1.965; 20 -1,1.965 | smd 2.5 x 2.5: 21 0,0
DECADE-SO-14 = smd 0.55 x 1.5: 1 -3.6,-2.88; 2 -2.33,-2.88; 3 -1.06,-2.88; 4 0.21,-2.88; 5 1.48,-2.88; 6 2.75,-2.88; 7 4.02,-2.88; 8 4.02,2.5; 9 2.75,2.5; 10 1.48,2.5; 11 0.21,2.5; 12 -1.06,2.5; 13 -2.33,2.5; 14 -3.6,2.5
ZX62R-B-5P = smd 1.35 x 0.4: 1 2.675,-1.3; 2 2.675,-0.65; 3 2.675,0; 4 2.675,0.65; 5 2.675,1.3 | smd 1.9 x 1.6: M1 0,-4.1; M2 0,4.1 | smd 2 x 2.1: M3 2.35,3.1; M4 2.35,-3.1
CRYSTAL_2.5X2 = smd 0.9 x 0.8: 1 -0.825,-0.625; 2 0.825,-0.625; 3 0.825,0.625; 4 -0.825,0.625

### Placement (x,y rotation side)
C1  34.7,17.61 270 top
C2  33.24,19.77 90 top
C3  19.81,18.3 270 top
C4  13.97,12.95 0 top
C5  10.41,4.57 0 top
C6  28.55,6.21 180 top
C7  17.02,6.35 270 top
CHRG  7.5,17.92 180 top
D3  16.76,9.91 270 top
DONE  7.48,16.32 180 top
J2  3.8,7.37 90 top
JP1  2.67,1.45 0 top
JP2  40.77,24.38 180 top
L1  14.48,3.81 0 top
L3  23.86,17.14 0 top
PWR  7.52,14.52 180 top
R1  19.87,10.83 270 top
R2  11.94,21.59 270 top
R3  11.18,10.67 270 top
R4  14.22,6.6 180 top
R5  9.14,10.67 270 top
R6  31.68,19.84 270 top
R7  20.02,6.98 90 top
R8  11.18,7.37 90 top
R9  18.26,21.43 90 top
R10  14.65,21.98 0 top
R11  10.16,16.26 0 top
R12  10.16,14.48 0 top
R13  14.48,5.33 0 top
R14  22.2,9.61 90 top
R15  17.09,12.88 0 top
R16  8.13,22.35 180 top
R17  30.33,19.84 270 top
R18  32.09,6.35 180 top
R19  37.43,6.3 90 top
R20  38.98,6.25 270 top
R21  42.23,18.65 270 top
R22  40.83,18.6 270 top
R23  23.99,7.83 270 top
R24  35.83,6.35 270 top
R25  27.67,19.94 270 top
R26  22.68,13.5 180 top
R27  26.18,19.94 90 top
R28  22.63,14.85 0 top
R29  22.68,12.1 180 top
R30  35.91,19.48 270 top
R31  24.62,20.03 90 top
R32  29.03,19.84 90 top
R33  25.5,7.89 90 top
R34  40.78,6.25 90 top
R35  10.16,18.03 0 top
S1  8.38,20.07 180 top
THERMAL  19.9,14.37 270 top
U2  29.7,12.81 270 top
U3  14.22,9.4 270 top
U5  38.26,18.97 270 top
U$1  31.5,12.7 90 bottom
U$3  15.13,17.34 90 top
U$4  39.12,12.34 90 top
USB  1.5,17.52 0 top
Y1  22.35,19.56 0 top

### Tracks (layer width: path | path; a pad name or v marks a point on that pad's centre or on a via)
+5V_USB  (via drill 0.3)
  Top 0.178: U$3.19 13.25,16.89 13.25,17.34 U$3.18 13.25,17.42 13.25,17.78 U$3.17 13.16,17.87 11.65,17.87 11.16,18.36 | 11.16,18.36 10.85,18.05 R35.2 10.85,17.96 10.85,16.27 R11.2 10.85,16.18 10.85,14.58 R12.2 | 11.16,18.36 11.2,18.4 11.2,22.76 11.38,22.94 11.82,22.94 12,23.11 18.94,23.11 19.11,22.94 19.11,20 19.02,19.91 19.02,19.29 17.6,17.87 17.16,17.87 U$3.9 | L3.1 23.02,17.07 23.02,16.36 24.18,15.2 24.18,14.67 24.71,14.13 25.43,14.13 U2.4 25.51,14.05 26.4,14.05 v26.58,13.87 | U$3.4 15.56,15.38 15.2,15.38 U$3.3 15.2,15.29 15.2,14.58 v15.29,14.49 | v13.51,14.49 10.85,14.49 R12.2 | 10.4,12.98 10.4,10.85 11.11,10.13 11.11,9.87 R3.2 | 10.4,12.98 10.76,13.34 10.76,14.4 R12.2 | v23.2,11.11 22.58,10.49 22.23,10.49 R14.2 | 10.4,12.98 7.11,12.98 6.04,14.05 6.04,14.67 4.53,16.18 4.18,16.18 USB.1
  Bottom 0.178: v13.51,14.49 v15.29,14.49 15.91,13.87 20.71,13.87 23.16,11.42 | v23.2,11.11 23.2,11.38 23.16,11.42 | v26.58,13.87 26.23,13.87 23.82,11.47 23.2,11.47 23.16,11.42
+5V_USB_F  (via drill 0.3)
  Top 0.178: U2.3 25.43,14.58 24.8,14.58 24.54,14.85 24.54,15.73 24.62,15.82 24.62,17.07 L3.2 24.71,17.16 v25.78,17.16 | v27.74,22.23 27.74,20.62 R25.1 | v29.69,18.31 29.69,17.96 29.87,17.78 29.87,17.07 U2.42
  Route2 0.178: v27.74,22.23 27.74,20.27 v29.69,18.31
  Bottom 0.178: v25.78,17.16 28.18,17.16 28.63,17.6 29.16,17.6 29.69,18.14 v29.69,18.31
+BATT  (via drill 0.3)
  Top 0.178: 13.47,18.62 U$3.15 14.22,19.29 14.58,19.29 U$3.14 | 13.47,18.62 13.25,18.4 U$3.16 | v18.14,10.94 19.02,10.05 19.82,10.05 R1.2 | v8.18,9.42 8.18,9.07 7.56,8.45 J2.2 | v12.62,19.47 13.47,18.62
  Route15 0.178: v12.62,19.47 12.62,18.05 18.14,12.54 v18.14,10.94
  Bottom 0.178: v18.14,10.94 9.69,10.94 v8.18,9.42
DBG_RST_N  (via drill 0.3)
  Top 0.178: R19.1 37.43,5.69 35.92,5.69 R24.2 35.74,5.69 35.03,6.4 v34.94,6.4 | v38.14,9.6 38.85,9.6 41.78,12.54 41.96,12.54 U$4.4
  Bottom 0.178: v38.14,9.6 v34.94,6.4
DBGEN_N
  Top 0.178: R18.1 32.8,6.31 33.96,6.31 35.29,4.98 39.56,4.98 40.01,5.42 40.01,6.04 40.18,6.22 41.34,6.22 41.96,6.84 41.96,8.71 U$4.1
FB
  Top 0.178: R13.1 13.6,5.33 11.91,7.02 11.91,7.29 11.2,8 R8.2 11.2,8.09 11.2,8.27 13.25,10.31 13.25,10.76 U3.3
FT_SK
  Top 0.178: R20.1 39.03,6.93 39.03,7.2 41.78,9.96 41.96,9.96 U$4.2
FTDI_RX
  Top 0.178: R6.1 31.74,20.54 31.74,23.02 33.07,24.36 JP2.4
  Bottom 0.178: U$1.G01 36.45,21.16 33.16,24.45 JP2.4
FTDI_TX
  Top 0.178: R17.1 30.4,20.54 30.4,21.69 30.76,22.05 30.76,24.27 30.67,24.36 JP2.5
  Bottom 0.178: U$1.G02 33.87,21.16 30.67,24.36 JP2.5
G00
  Bottom 0.178: U$1.G00 38.49,21.6 35.74,24.36 JP2.3
GND  (via drill 0.3)
  Top 0.178: C2.1 33.43,19.11 34.23,18.31 34.67,18.31 C1.1 34.67,18.4 34.85,18.58 34.85,19.02 35.29,19.47 36.45,19.47 36.63,19.29 37.78,19.29 38.23,19.74 38.23,20.18 U5.2 38.23,19.65 38.41,19.65 39.12,18.94 v39.38,18.94 | 41.38,17.02 41.96,16.45 U$4.7 | 41.38,17.02 40.89,17.51 40.89,17.87 R22.2 | 28.23,16.22 28.45,16.45 U2.45 | 28.23,16.22 28.18,16.18 27.74,16.18 27.47,16.45 27.47,16.98 U2.47 | v29.96,5.42 29.25,6.13 C6.1 | v28.8,14.94 28.27,15.47 28.27,16.18 28.23,16.22 | v41.52,17.16 41.38,17.02 | C3.1 19.74,18.94 19.74,18.76 19.02,18.05 19.02,16.09 19.82,15.29 THERMAL.1 | THERMAL.1 19.47,15.56 18.85,14.94 17.6,14.94 15.2,17.34 U$3.21 15.2,17.42 16.62,18.85 | USB.5 4.18,18.85 4.53,18.85 5.16,19.47 5.16,21.25 7.02,23.11 8,23.11 8.71,22.4 R16.1 8.8,22.4 10.31,22.4 11.47,23.56 v11.56,23.56 | R2.1 12,22.23 13.6,22.23 13.78,22.05 R10.1 13.87,21.96 13.87,21.69 v14.58,20.98 | 16.62,18.85 17.07,18.4 U$3.10 | 16.62,18.85 16.58,18.89 | 16.58,18.89 16.18,19.29 U$3.11 16.27,19.29 v16.27,20.18 | 16.58,18.89 18.22,20.54 R9.1 | 29.56,9.29 30.32,10.05 33.07,10.05 | 29.56,9.29 29.52,9.25 29.52,8.62 U2.18 | 33.07,10.05 33.87,10.05 U2.25 | 29.56,9.29 28.85,10 | 28.85,10 27.29,11.56 25.51,11.56 U2.9 25.43,11.56 24.8,11.56 22.85,9.6 21.6,9.6 21.47,9.47 | 33.07,10.05 33.07,14.31 33.25,14.49 33.87,14.49 U2.34 | 11.2,6.31 v11.2,5.87 11.2,4.62 C5.2 | 11.2,6.31 11.2,6.67 R8.1 | 11.2,6.31 7.56,6.31 J2.1 | 17.47,8.67 17.96,8.18 17.96,6.67 17.91,6.62 | 17.47,8.67 17.42,8.71 16.8,8.71 D3.A | 17.91,6.62 17.07,5.78 C7.2 | 17.91,6.62 18.4,6.13 20,6.13 R7.1 20,6.22 21.07,7.29 21.07,9.07 21.47,9.47 | 17.47,8.67 17.51,8.71 17.51,11.56 16.27,12.8 R15.1 16.18,12.89 14.85,12.89 C4.2 14.85,12.8 14.22,12.18 U3.2 14.22,10.76 14.31,10.67 v14.31,9.6
  Top 0.178: THERMAL.1 19.91,15.2 19.91,15.02 20.98,13.96 20.98,10.85 21.43,10.4 21.43,9.51 21.47,9.47 | v28.89,10.05 28.85,10
  Bottom 0.178: 41.47,5.29 42.49,4.27 U$1.GND 42.49,4.18 40.8,2.49 40.8,1.51 JP1.16 | 41.47,5.29 41.34,5.42 v29.96,5.42 28.8,6.58 28.8,10.05 | 28.8,10.05 v28.8,14.94 | 41.47,5.29 41.52,5.33 v41.52,17.16 39.74,18.94 v39.38,18.94 | v16.27,20.18 15.47,20.98 v14.58,20.98 14.49,20.98 11.91,23.56 v11.56,23.56 | v11.2,5.87 11.2,6.49 v14.31,9.6 | v28.89,10.05 28.8,10.05
GPIO_05
  Top 0.178: R1.1 19.91,11.65 19.91,11.38 20.71,10.58 20.71,8.53 20.09,7.91 R7.2
N$1
  Top 0.178: 7.42,21.74 6.58,20.89 S1.4 | 7.42,21.74 7.47,21.78 7.47,22.31 R16.2 | 7.42,21.74 8.27,20.89 10.22,20.89 S1.3
N$2
  Bottom 0.178: U$1.TMS 40.45,4.18 40.45,3.73 38.23,1.51 JP1.15
N$3
  Bottom 0.178: U$1.TCK 38.49,4.18 35.74,1.42 JP1.14
N$4
  Bottom 0.178: U$1.G28 36.45,4.18 35.83,4.18 33.16,1.51 JP1.13
N$5
  Bottom 0.178: U$1.TDO 34.49,4.18 33.87,4.18 31.2,1.51 30.67,1.51 JP1.12
N$6
  Bottom 0.178: U$1.TDI 32.45,4.18 31.83,4.18 30.32,2.67 29.25,2.67 28.09,1.51 JP1.11
N$7
  Bottom 0.178: U$1.G22 30.49,4.18 29.87,4.18 28.36,2.67 26.76,2.67 25.6,1.51 JP1.10
N$8
  Top 0.178: R26.1 23.38,13.51 25.43,13.51 U2.5
N$9
  Bottom 0.178: U$1.SOP0 26.49,4.18 25.87,4.18 24.36,2.67 21.6,2.67 20.45,1.51 JP1.8
N$11
  Top 0.178: R4.1 14.85,6.67 13.51,8 13.34,8 U3.4
N$12
  Bottom 0.178: U$1.G31 42.49,22.67 40.8,24.36 JP2.1
N$13
  Bottom 0.178: U$1.G30 40.45,21.16 40.45,22.14 38.23,24.36 JP2.2
N$17
  Bottom 0.178: U$1.G03 32.45,21.16 31.91,21.16 30.76,22.31 29.87,22.31 28.09,24.09 28.09,24.36 JP2.6
N$18
  Bottom 0.178: U$1.G04 29.87,21.16 27.91,23.11 26.85,23.11 25.6,24.36 JP2.7
N$19
  Bottom 0.178: U$1.G05 28.45,21.16 27.91,21.16 25.96,23.11 24.54,23.11 23.29,24.36 23.02,24.36 JP2.8
N$20
  Bottom 0.178: U$1.G06 25.96,21.16 24,23.11 21.69,23.11 20.45,24.36 JP2.9
N$21
  Bottom 0.178: U$1.G07 24.45,21.16 24.45,21.78 23.47,22.76 20.36,22.76 18.76,24.36 17.96,24.36 JP2.10
N$22
  Bottom 0.178: U$1.G08 21.43,21.16 19.47,23.11 16.62,23.11 15.38,24.36 JP2.11
N$23
  Bottom 0.178: U$1.G09 20.45,20.71 16.62,20.71 12.89,24.45 JP2.12
N$24
  Bottom 0.178: U$1.G17 20.45,4.62 14.76,4.62 12.89,2.76 12.89,1.51 JP1.5
N$25
  Bottom 0.178: U$1.G10 20.45,18.76 18.14,18.76 17.34,19.56 14.67,19.56 10.31,23.91 10.31,24.36 JP2.13
N$26
  Bottom 0.178: U$1.G11 20.45,16.71 19.65,16.71 17.51,18.85 12.36,18.85 7.82,23.38 7.82,24.36 JP2.14
N$27
  Bottom 0.178: U$1.G12 20.45,14.76 15.91,14.76 14.22,16.45 9.6,16.45 5.25,20.8 5.25,24.36 JP2.15
N$28
  Bottom 0.178: JP2.16 2.67,22.85 12.8,12.71 20.45,12.71 U$1.G13
N$29
  Bottom 0.178: U$1.G16 20.45,6.67 15.47,6.67 10.31,1.51 JP1.4
N$30
  Bottom 0.178: U$1.G15 20.45,8.62 15.38,8.62 8.27,1.51 7.82,1.51 JP1.3
N$31
  Bottom 0.178: U$1.G14 20.45,10.67 18.76,10.67 17.07,8.98 15.2,8.98 8.89,2.67 6.4,2.67 5.25,1.51 JP1.2
N$38  (via drill 0.3)
  Top 0.178: v24.09,18.22 22.58,18.22 22.4,18.4 22.4,19.47 23.11,20.18 Y1.3 | v28.89,18.22 29.43,17.69 29.43,17.07 U2.43 29.43,16.98 29.43,16.45 29.87,16 v31.03,16 | v34.23,19.2 34.23,19.38 33.25,20.36 C2.2
  Bottom 0.178: v24.09,18.22 27.29,18.22 27.83,18.76 28.36,18.76 v28.89,18.22 | v31.03,16 v34.23,19.2
N$39  (via drill 0.3)
  Top 0.178: R27.1 26.23,19.2 26.23,17.78 26.94,17.07 U2.48 27.03,16.98 27.03,15.73 28.54,14.22 30.14,14.22 v31.91,16 | v37.87,16.62 38.23,16.98 38.23,17.69 U5.5
  Bottom 0.178: v37.87,16.62 32.54,16.62 v31.91,16
N$40  (via drill 0.3)
  Top 0.178: C3.2 19.82,17.69 20.36,17.69 21.51,18.85 Y1.1 21.34,18.58 v21.96,17.96 | v28.89,15.91 28.89,16.98 U2.44
  Bottom 0.178: v28.89,15.91 28.54,15.91 27.11,14.49 25.43,14.49 v21.96,17.96
N$41  (via drill 0.3)
  Top 0.178: v34.94,20.09 35.83,20.09 R30.1 | v36.54,17.96 37.07,17.96 37.25,17.78 U5.4 | v26.05,16.18 25.51,15.65 U2.1
  Bottom 0.178: 34.94,19.82 34.94,19.56 v36.54,17.96 | v26.05,16.18 27.74,16.18 28.8,17.25 30.49,17.25 33.07,19.82 34.94,19.82 | 34.94,19.82 v34.94,20.09
N$42  (via drill 0.3)
  Top 0.178: 32.4,19.96 32.45,20 32.45,20.89 32.63,21.07 36.45,21.07 37.25,20.27 U5.3 | 32.4,19.96 32.27,19.82 29.69,19.82 29.07,19.2 R32.1 | v26.58,15.11 25.51,15.11 U2.2 | v32.27,18.14 32.27,18.58 32.45,18.76 32.45,19.91 32.4,19.96
  Bottom 0.178: v26.58,15.11 27.2,15.11 28.71,16.62 30.76,16.62 v32.27,18.14
N$43
  Top 0.178: C1.2 34.67,16.89 33.69,16.89 29.87,13.07 25.51,13.07 U2.6
N$44
  Top 0.178: R17.2 30.4,19.11 30.4,18.22 30.94,17.69 30.94,17.07 U2.40
N$45
  Top 0.178: R6.2 31.65,19.11 31.65,17.87 31.47,17.69 31.47,17.07 U2.39
N$46
  Top 0.178: R20.2 38.94,5.69 38.58,5.69 37.96,6.31 36.8,6.31 36.63,6.49 36.63,7.47 36.01,8.09 32.89,8.09 32.45,8.53 U2.24
N$47
  Top 0.178: R19.2 37.52,7.02 37.52,8.18 37.69,8.36 37.69,9.16 37.43,9.42 30.23,9.42 29.96,9.16 29.96,8.62 U2.19
N$48
  Top 0.178: R18.2 31.38,6.4 30.49,6.4 28.98,7.91 28.98,8.53 U2.17
N$49
  Top 0.178: R22.1 40.8,19.2 40.09,18.49 40.09,15.56 41.78,13.87 41.96,13.87 U$4.5
N$50
  Top 0.178: R21.1 42.32,19.29 42.32,19.11 43.03,18.4 43.03,15.91 42.23,15.11 42.05,15.11 U$4.6
N$51  (via drill 0.3)
  Top 0.178: v27.91,7.47 27.91,6.22 C6.2 | U2.46 28,17.07 28,17.78 28.09,17.87 v28.09,18.14 27.74,18.49 27.74,19.2 R25.2
  Route2 0.178: v27.91,7.47 27.91,9.42 28.27,9.78 28.27,14.49 28.09,14.67 v28.09,18.14
N$54  (via drill 0.3)
  Top 0.178: R31.1 24.62,19.47 25.16,19.47 25.6,19.91 28.45,19.91 28.98,20.45 R32.2 29.07,20.54 29.07,20.89 30.14,21.96 v30.14,22.94 | v32.98,22.94 36.8,22.94 39.12,20.62 39.12,20.27 U5.1
  Route2 0.178: v30.14,22.94 v32.98,22.94
N$55
  Top 0.178: R33.2 25.51,8.62 25.51,8.98 26.31,9.78 26.31,10.85 26.14,11.02 25.51,11.02 U2.10
N$56  (via drill 0.3)
  Top 0.178: v40.72,7.82 40.72,6.93 R34.2 | v38.14,10.49 37.6,10.49 37.52,10.58 33.96,10.58 U2.26
  Bottom 0.178: v40.72,7.82 38.76,9.78 38.76,9.87 v38.14,10.49
N$68
  Top 0.178: U$3.12 15.65,19.38 15.65,20.45 17.42,22.23 18.22,22.23 R9.2
N$69
  Top 0.178: U$3.13 15.2,19.38 15.2,21.69 15.47,21.96 R10.2
N$70  (via drill 0.3)
  Top 0.178: v17.96,16.09 17.78,16.27 17.16,16.27 U$3.6 | v10.13,13.6 7.73,13.6 6.84,14.49 PWR.A
  Route2 0.178: v17.96,16.09 12.62,16.09 v10.13,13.6
N$71  (via drill 0.3)
  Top 0.178: v18.58,15.56 18.58,16.36 18.14,16.8 17.16,16.8 U$3.7 | v7.47,15.38 7.47,15.56 6.76,16.27 DONE.A
  Route2 0.178: v18.58,15.56 18.31,15.56 15.73,12.98 9.87,12.98 v7.47,15.38
N$72  (via drill 0.3)
  Top 0.178: v18.05,17.42 17.96,17.34 17.16,17.34 U$3.8 | v7.73,19.91 5.78,19.91 5.6,19.74 5.6,18.85 6.49,17.96 6.67,17.96 CHRG.A
  Bottom 0.178: v18.05,17.42 10.76,17.42 8.27,19.91 v7.73,19.91
N$73
  Top 0.178: CHRG.C 8.27,17.96 9.42,17.96 R35.1
N$74
  Top 0.178: DONE.C 8.27,16.27 9.42,16.27 R11.1
N$75
  Top 0.178: PWR.C 8.36,14.49 9.42,14.49 R12.1
N$76  (via drill 0.3)
  Top 0.178: U$3.2 14.67,15.29 14.67,14.22 15.11,13.78 16.98,13.78 17.87,12.89 R15.2 17.96,12.8 v18.85,11.91 | v23.47,9.34 22.94,8.8 22.23,8.8 R14.1
  Bottom 0.178: v23.47,9.34 23.29,9.34 20.71,11.91 v18.85,11.91
N$77
  Top 0.178: U$3.5 16.18,15.29 16.71,15.29 18.31,13.69 19.74,13.69 19.82,13.6 THERMAL.2
OUT  (via drill 0.3)
  Top 0.178: 13.07,8.98 14.22,8.98 15.11,8.09 U3.5 | 13.07,8.98 12.89,8.98 12.71,8.8 12.71,7.2 13.25,6.67 13.51,6.67 R4.2 | U$3.20 13.25,16.27 U$3.1 14.13,15.29 14.13,13.96 13.16,12.98 C4.1 13.07,12.89 11.78,11.6 | 11.78,11.6 11.73,11.56 11.2,11.56 R3.1 | v13.07,9.25 13.07,8.98 | v12.18,10.13 12.18,11.2 11.78,11.6
  Bottom 0.178: v12.18,10.13 v13.07,9.25
RST  (via drill 0.3)
  Top 0.178: v10.4,8.8 10.4,10.05 9.16,11.29 R5.1 | v42.32,17.16 42.32,17.96 R21.2 | v42.49,5.25 42.14,5.25 39.56,2.67 19.11,2.67 17.96,1.51 JP1.7 | v8.09,18.85 7.73,19.2 6.58,19.2 S1.2
  Route2 0.178: v10.4,8.8 10.58,8.8 17.87,1.51 JP1.7
  Route15 0.178: v8.09,18.85 8.09,11.11 v10.4,8.8
  Bottom 0.178: v42.32,17.16 42.32,5.42 v42.49,5.25 | U$1.RST 24.45,4.18 23.82,4.18 22.67,3.02 19.47,3.02 17.96,1.51 JP1.7
SOP2  (via drill 0.3)
  Top 0.178: v24,6.31 24,7.11 R23.2 | v13.42,19.56 12.89,20.09 12.8,20.09 12,20.89 R2.2
  Route15 0.178: v13.42,19.56 13.42,18.22 24,7.64 v24,6.31
  Bottom 0.178: v24,6.31 26.4,6.31 28.45,4.27 U$1.SOP2
SW
  Top 0.178: 16,11.02 15.38,11.02 15.2,10.85 U3.1 | 16,11.02 16.71,11.02 D3.C | 16,11.02 16,8.36 16.09,8.27 16.09,3.11 15.82,2.85 14.22,2.85 13.6,3.47 13.6,3.73 L1.1
TCK
  Top 0.178: R23.1 24,8.45 24.71,7.73 24.71,5.51 25.78,4.45 40.8,4.45 43.03,6.67 43.03,10.4 42.23,11.2 42.05,11.2 U$4.3
USB_D+  (via drill 0.3)
  Top 0.178: v22.58,15.73 23.2,15.11 23.2,14.94 R28.2 | v10.13,17.16 5.16,17.16 4.8,17.51 USB.3
  Bottom 0.178: v22.58,15.73 19.29,15.73 18.22,16.8 10.49,16.8 v10.13,17.16
USB_D-  (via drill 0.3)
  Top 0.178: v21.51,16.98 21.34,16.8 21.34,12.98 21.96,12.36 21.96,12.18 R29.2 | v5.78,16.54 5.16,16.54 4.89,16.8 4.18,16.8 USB.2
  Route2 0.178: v21.51,16.98 18.49,16.98 18.22,16.71 10.58,16.71 10.4,16.54 v5.78,16.54
USB_DM
  Top 0.178: R29.1 23.38,12.09 25.43,12.09 U2.8
USB_DP  (via drill 0.3)
  Top 0.178: R26.2 22.05,13.51 22.05,14.85 R28.1 21.96,14.94 21.96,16 22.05,16.09 v22.05,16.36 | v24.36,12.89 24.62,12.62 25.43,12.62 U2.7
  Bottom 0.178: v24.36,12.89 24.36,14.85 22.85,16.36 v22.05,16.36
VCC  (via drill 0.3)
  Top 0.178: U5.6 39.12,17.78 39.12,18.22 38.58,18.76 35.92,18.76 R30.2 35.92,18.67 35.56,18.31 35.56,14.05 34.63,13.11 | 34.63,13.11 34.58,13.07 U2.31 | 26.8,7.33 27.38,7.91 27.38,8.53 U2.14 | 26.8,7.33 26.76,7.29 25.51,7.29 R33.1 25.43,7.2 v25.43,5.69 | 34.85,7.02 33.25,7.02 33.16,7.11 32.27,7.11 32.09,6.93 32.09,5.78 31.11,4.8 28.09,4.8 26.85,6.04 26.85,7.29 26.8,7.33 | 34.85,7.02 35.83,7.02 R24.1 | v35.38,8.71 36.54,8.71 U$4.14 | 34.85,7.02 v34.85,7.47 | v35.03,12.71 34.63,13.11 | R5.2 9.07,10.05 5.96,10.05 4.89,8.98 4.89,5.78 6.04,4.62 9.51,4.62 C5.1 9.6,4.53 9.87,4.53 11.73,2.67 13.87,2.67 15.02,1.51 15.29,1.51 JP1.6 | R13.2 15.2,5.33 15.2,3.91 15.29,3.82 L1.2 15.2,3.82 14.85,3.82 v14.49,3.47 | R27.2 26.14,20.62 24.62,20.62 R31.2 24.54,20.71 23.47,21.78 v23.47,21.87 | v17.34,7.91 17.07,7.64 17.07,7.02 C7.1
  Route2 0.178: v23.47,21.87 23.47,14.05 v17.34,7.91
  Bottom 0.178: v34.85,7.47 35.38,8 v35.38,8.71 35.03,9.07 v35.03,12.71 | JP1.6 15.29,1.51 14.49,2.31 v14.49,3.47 21.6,3.47 22.4,4.27 U$1.VCC 22.49,4.27 22.49,5.69 | v17.34,7.91 20.71,7.91 22.49,6.13 22.49,5.69 | 22.49,5.69 v25.43,5.69